# Altium project Test Carrier Bd.PrjPcb (part 1 of 2)
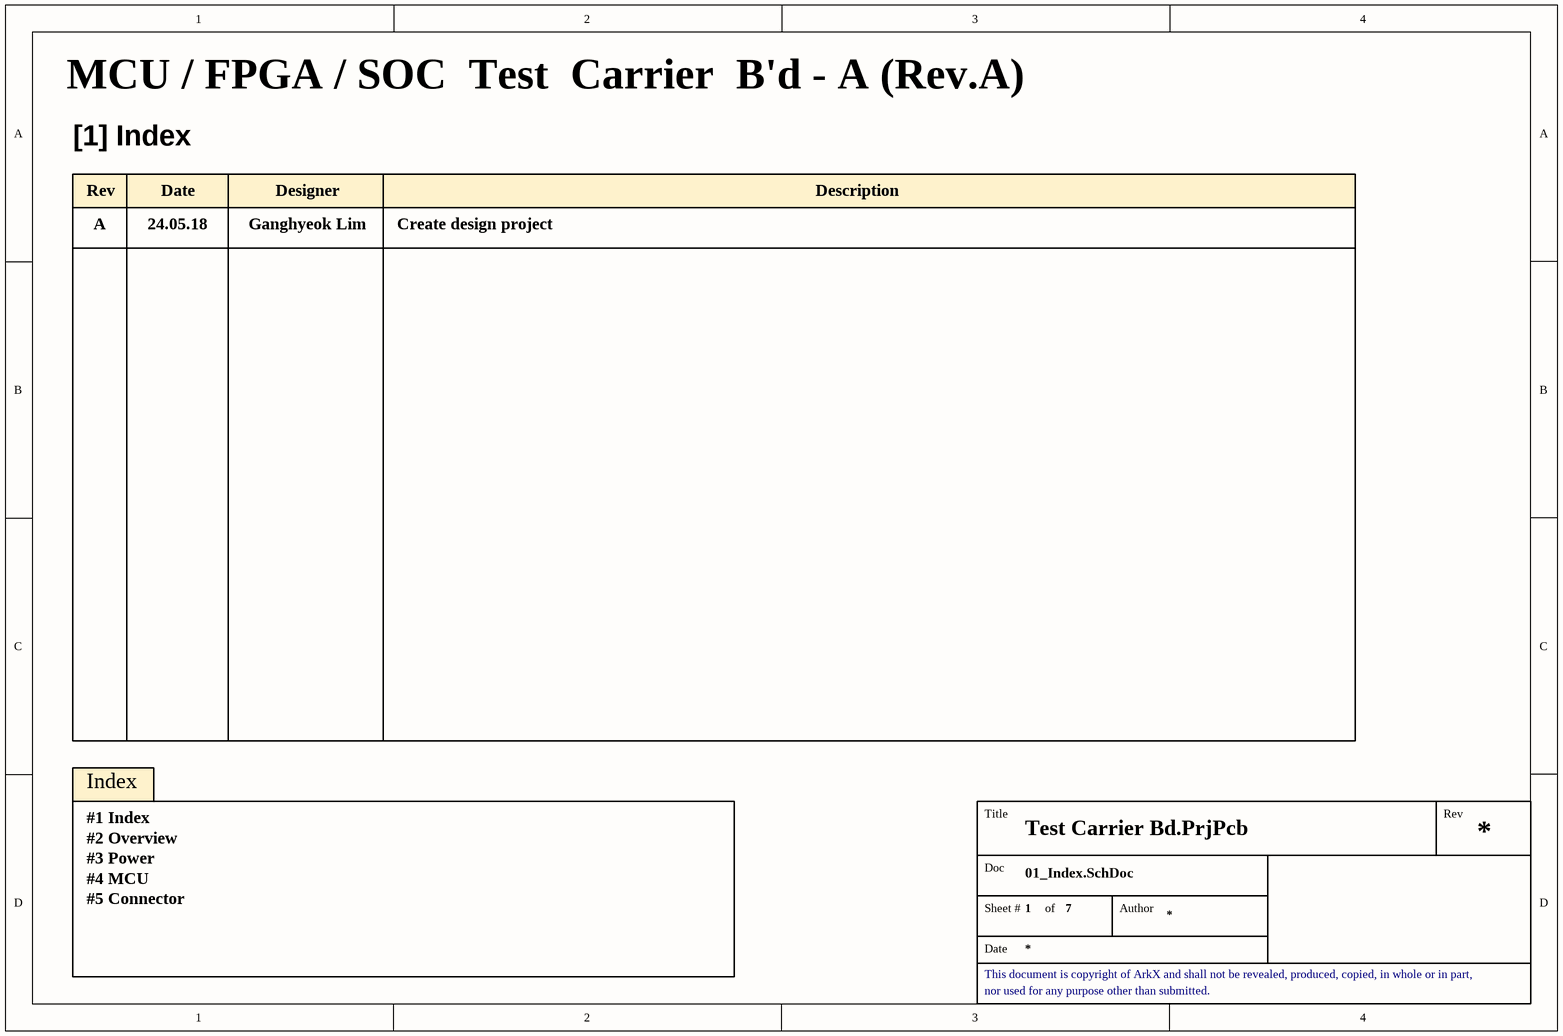
[diagram p0: 01_Index.SchDoc]
8 sheets, 219 parts. Net scope: global (net labels, ports and power ports of the same name join across sheets).
Board file: Test_Carrier_Bd.PcbDoc
Sheets:
  01_Index.SchDoc
  02_Overview.SchDoc
  03_Power.SchDoc
  04_MCU_Part.SchDoc
  05_FPGA_SOC_Part1.SchDoc
  06_FPGA_SOC_Part2.SchDoc
  07_Peripheral_Part.SchDoc
  08_Target_Bd_Connector.SchDoc

## Sheet 01_Index.SchDoc
size A4; SheetNumber: 1; SheetTotal: 7

### Notes on the sheet
- MCU / FPGA / SOC  Test  Carrier  B'd - A (Rev.A)
- [1] Index
- Rev
- A
- 24.05.18
- Date
- Ganghyeok Lim
- Designer
- Create design project
- Description
- Index
- #1 Index
- #2 Overview
- #3 Power
- #4 MCU
- #5 Connector
- Title
- Doc
- Sheet #
- of
- Author
- This document is copyright of ArkX and shall not be revealed, produced, copied, in whole or in part,
- nor used for any purpose other than submitted.

## Sheet 02_Overview.SchDoc
size A4; SheetNumber: 2; SheetTotal: 7
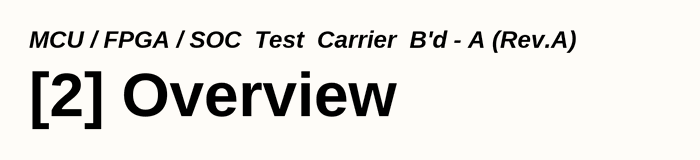
[diagram p1: 02_Overview.SchDoc]

### Notes on the sheet
- MCU / FPGA / SOC  Test  Carrier  B'd - A (Rev.A)
- [2] Overview
- Title
- Rev
- Doc
- Sheet #
- of
- Author
- This document is copyright of ArkX and shall not be revealed, produced, copied, in whole or in part,
- Date
- nor used for any purpose other than submitted.

## Sheet 03_Power.SchDoc
size A4; SheetNumber: 3; SheetTotal: 8
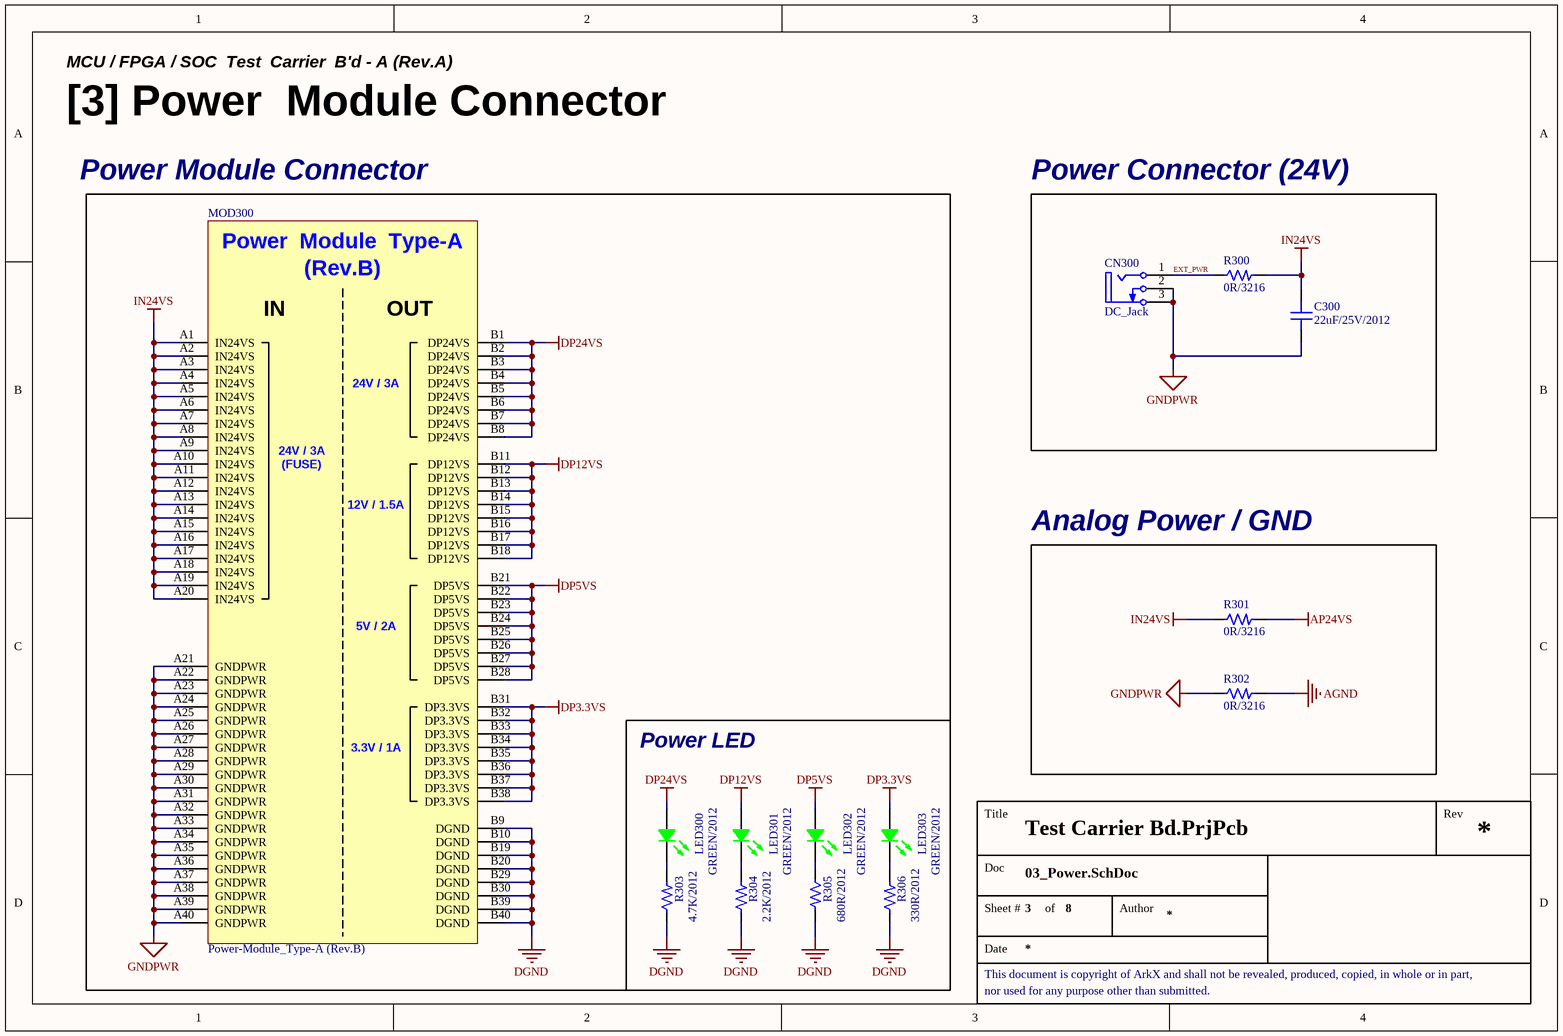
[diagram p2: 03_Power.SchDoc]

### Parts
C300  22uF/25V/2012  [CAP 2012 (0805_INCH)]
CN300  DC_Jack  [CON_DC-JACK]
LED300  GREEN/2012  [LED MHT170RGBCT (GREEN)]
LED301  GREEN/2012  [LED MHT170RGBCT (GREEN)]
LED302  GREEN/2012  [LED MHT170RGBCT (GREEN)]
LED303  GREEN/2012  [LED MHT170RGBCT (GREEN)]
MOD300  Power-Module_Type-A (Rev.B)  [MOD_Power-Module_Type-A (Rev.B)]
R300  0R/3216  [RES 3216 (1206_inch)]
R301  0R/3216  [RES 3216 (1206_inch)]
R302  0R/3216  [RES 3216 (1206_inch)]
R303  4.7K/2012  [RES 2012 (0805_inch)]
R304  2.2K/2012  [RES 2012 (0805_inch)]
R305  680R/2012  [RES 2012 (0805_inch)]
R306  330R/2012  [RES 2012 (0805_inch)]

### Blocks framed on the sheet
Power Connector (24V): C300 CN300 R300
Analog Power / GND: R301 R302
Power LED: LED300-LED303 R303-R306

### Nets
AGND: R302.2
AP24VS: R301.2
DGND: MOD300.B9(DGND) MOD300.B10(DGND) MOD300.B19(DGND) MOD300.B20(DGND) MOD300.B29(DGND) MOD300.B30(DGND) MOD300.B39(DGND) MOD300.B40(DGND) R303.1 R304.1 R305.2 R306.1
DP3.3VS: LED303.4(Common_Anode) MOD300.B31(DP3.3VS) MOD300.B32(DP3.3VS) MOD300.B33(DP3.3VS) MOD300.B34(DP3.3VS) MOD300.B35(DP3.3VS) MOD300.B36(DP3.3VS) MOD300.B37(DP3.3VS) MOD300.B38(DP3.3VS)
DP5VS: LED302.4(Common_Anode) MOD300.B21(DP5VS) MOD300.B22(DP5VS) MOD300.B23(DP5VS) MOD300.B24(DP5VS) MOD300.B25(DP5VS) MOD300.B26(DP5VS) MOD300.B27(DP5VS) MOD300.B28(DP5VS)
DP12VS: LED301.4(Common_Anode) MOD300.B11(DP12VS) MOD300.B12(DP12VS) MOD300.B13(DP12VS) MOD300.B14(DP12VS) MOD300.B15(DP12VS) MOD300.B16(DP12VS) MOD300.B17(DP12VS) MOD300.B18(DP12VS)
DP24VS: LED300.4(Common_Anode) MOD300.B1(DP24VS) MOD300.B2(DP24VS) MOD300.B3(DP24VS) MOD300.B4(DP24VS) MOD300.B5(DP24VS) MOD300.B6(DP24VS) MOD300.B7(DP24VS) MOD300.B8(DP24VS)
GNDPWR: C300.2 CN300.2(GND) CN300.3(GND) MOD300.A21(GNDPWR) MOD300.A22(GNDPWR) MOD300.A23(GNDPWR) MOD300.A24(GNDPWR) MOD300.A25(GNDPWR) MOD300.A26(GNDPWR) MOD300.A27(GNDPWR) MOD300.A28(GNDPWR) MOD300.A29(GNDPWR) MOD300.A30(GNDPWR) MOD300.A31(GNDPWR) MOD300.A32(GNDPWR) MOD300.A33(GNDPWR) MOD300.A34(GNDPWR) MOD300.A35(GNDPWR) MOD300.A36(GNDPWR) MOD300.A37(GNDPWR) MOD300.A38(GNDPWR) MOD300.A39(GNDPWR) MOD300.A40(GNDPWR) R302.1
IN24VS: C300.1 MOD300.A1(IN24VS) MOD300.A2(IN24VS) MOD300.A3(IN24VS) MOD300.A4(IN24VS) MOD300.A5(IN24VS) MOD300.A6(IN24VS) MOD300.A7(IN24VS) MOD300.A8(IN24VS) MOD300.A9(IN24VS) MOD300.A10(IN24VS) MOD300.A11(IN24VS) MOD300.A12(IN24VS) MOD300.A13(IN24VS) MOD300.A14(IN24VS) MOD300.A15(IN24VS) MOD300.A16(IN24VS) MOD300.A17(IN24VS) MOD300.A18(IN24VS) MOD300.A19(IN24VS) MOD300.A20(IN24VS) R300.2 R301.1
EXT_PWR: CN300.1(VCC) R300.1
NetLED300_2: LED300.2(GREEN) R303.2
NetLED301_2: LED301.2(GREEN) R304.2
NetLED302_2: LED302.2(GREEN) R305.1
NetLED303_2: LED303.2(GREEN) R306.2

### Notes on the sheet
- MCU / FPGA / SOC  Test  Carrier  B'd - A (Rev.A)
- [3] Power  Module Connector
- Power Module Connector
- Title
- Rev
- Doc
- Sheet #
- of
- Author
- This document is copyright of ArkX and shall not be revealed, produced, copied, in whole or in part,
- Date
- nor used for any purpose other than submitted.
- (in symbol MOD_Power-Module_Type-A (Rev.B)) Power  Module  Type-A; (Rev.B); IN; OUT; 24V / 3A; (FUSE); 12V / 1.5A; 5V / 2A; 3.3V / 1A

### Library data of the parts
C300 = CAP_22uF/25V/2012: Ceramic CAP_22uF/25V/2012; LCSC Part #: C45783; JLCPCB Part Type: Basic Part
CN300 = CON_DC-Jack: ComponentLink1Description: Manufacturer Link; ComponentLink1URL: http://www.cliffuk.co.uk/
LED300-LED303 = LED_MHT170RGBCT(GREEN): Colorless transparence -30℃~+85℃ Positive post Common anode RGB 120° 0805  Light Emitting Diodes (LED) ROHS; LCSC Part #: C2962094; JLCPCB Part Type: Extended Part
MOD300 = MOD_Power-Module_Type-A (Rev.B): Power-Module_(Type-A / Rev.B)
R300-R302 = RES_0R/3216/0.25W: Power Rating: 0.1W; Precision: 1%; Size: 1608; LCSC Part #: C17888; JLCPCB Part Type: Basic Part
R303 = RES_4.7K/2012/0.125W: Value: 4.7K; Power Rating: 0.125W; Precision: 1%; Size: 2012; LCSC Part #: C17673; JLCPCB Part Type: Basic Part
R304 = RES_2.2K/2012/0.125W: Value: 2.2K; Power Rating: 0.125W; Precision: 1%; Size: 2012; LCSC Part #: C17520; JLCPCB Part Type: Basic Part
R305 = RES_680R/2012/0.125W: Value: 680R; Power Rating: 0.125W; Precision: 1%; Size: 2012; LCSC Part #: C17798; JLCPCB Part Type: Basic Part
R306 = RES_330R/2012/0.125W: Value: 330R; Power Rating: 0.125W; Precision: 1%; Size: 2012; LCSC Part #: C17630; JLCPCB Part Type: Basic Part

## Sheet 04_MCU_Part.SchDoc
size A3; SheetNumber: 4; SheetTotal: 8
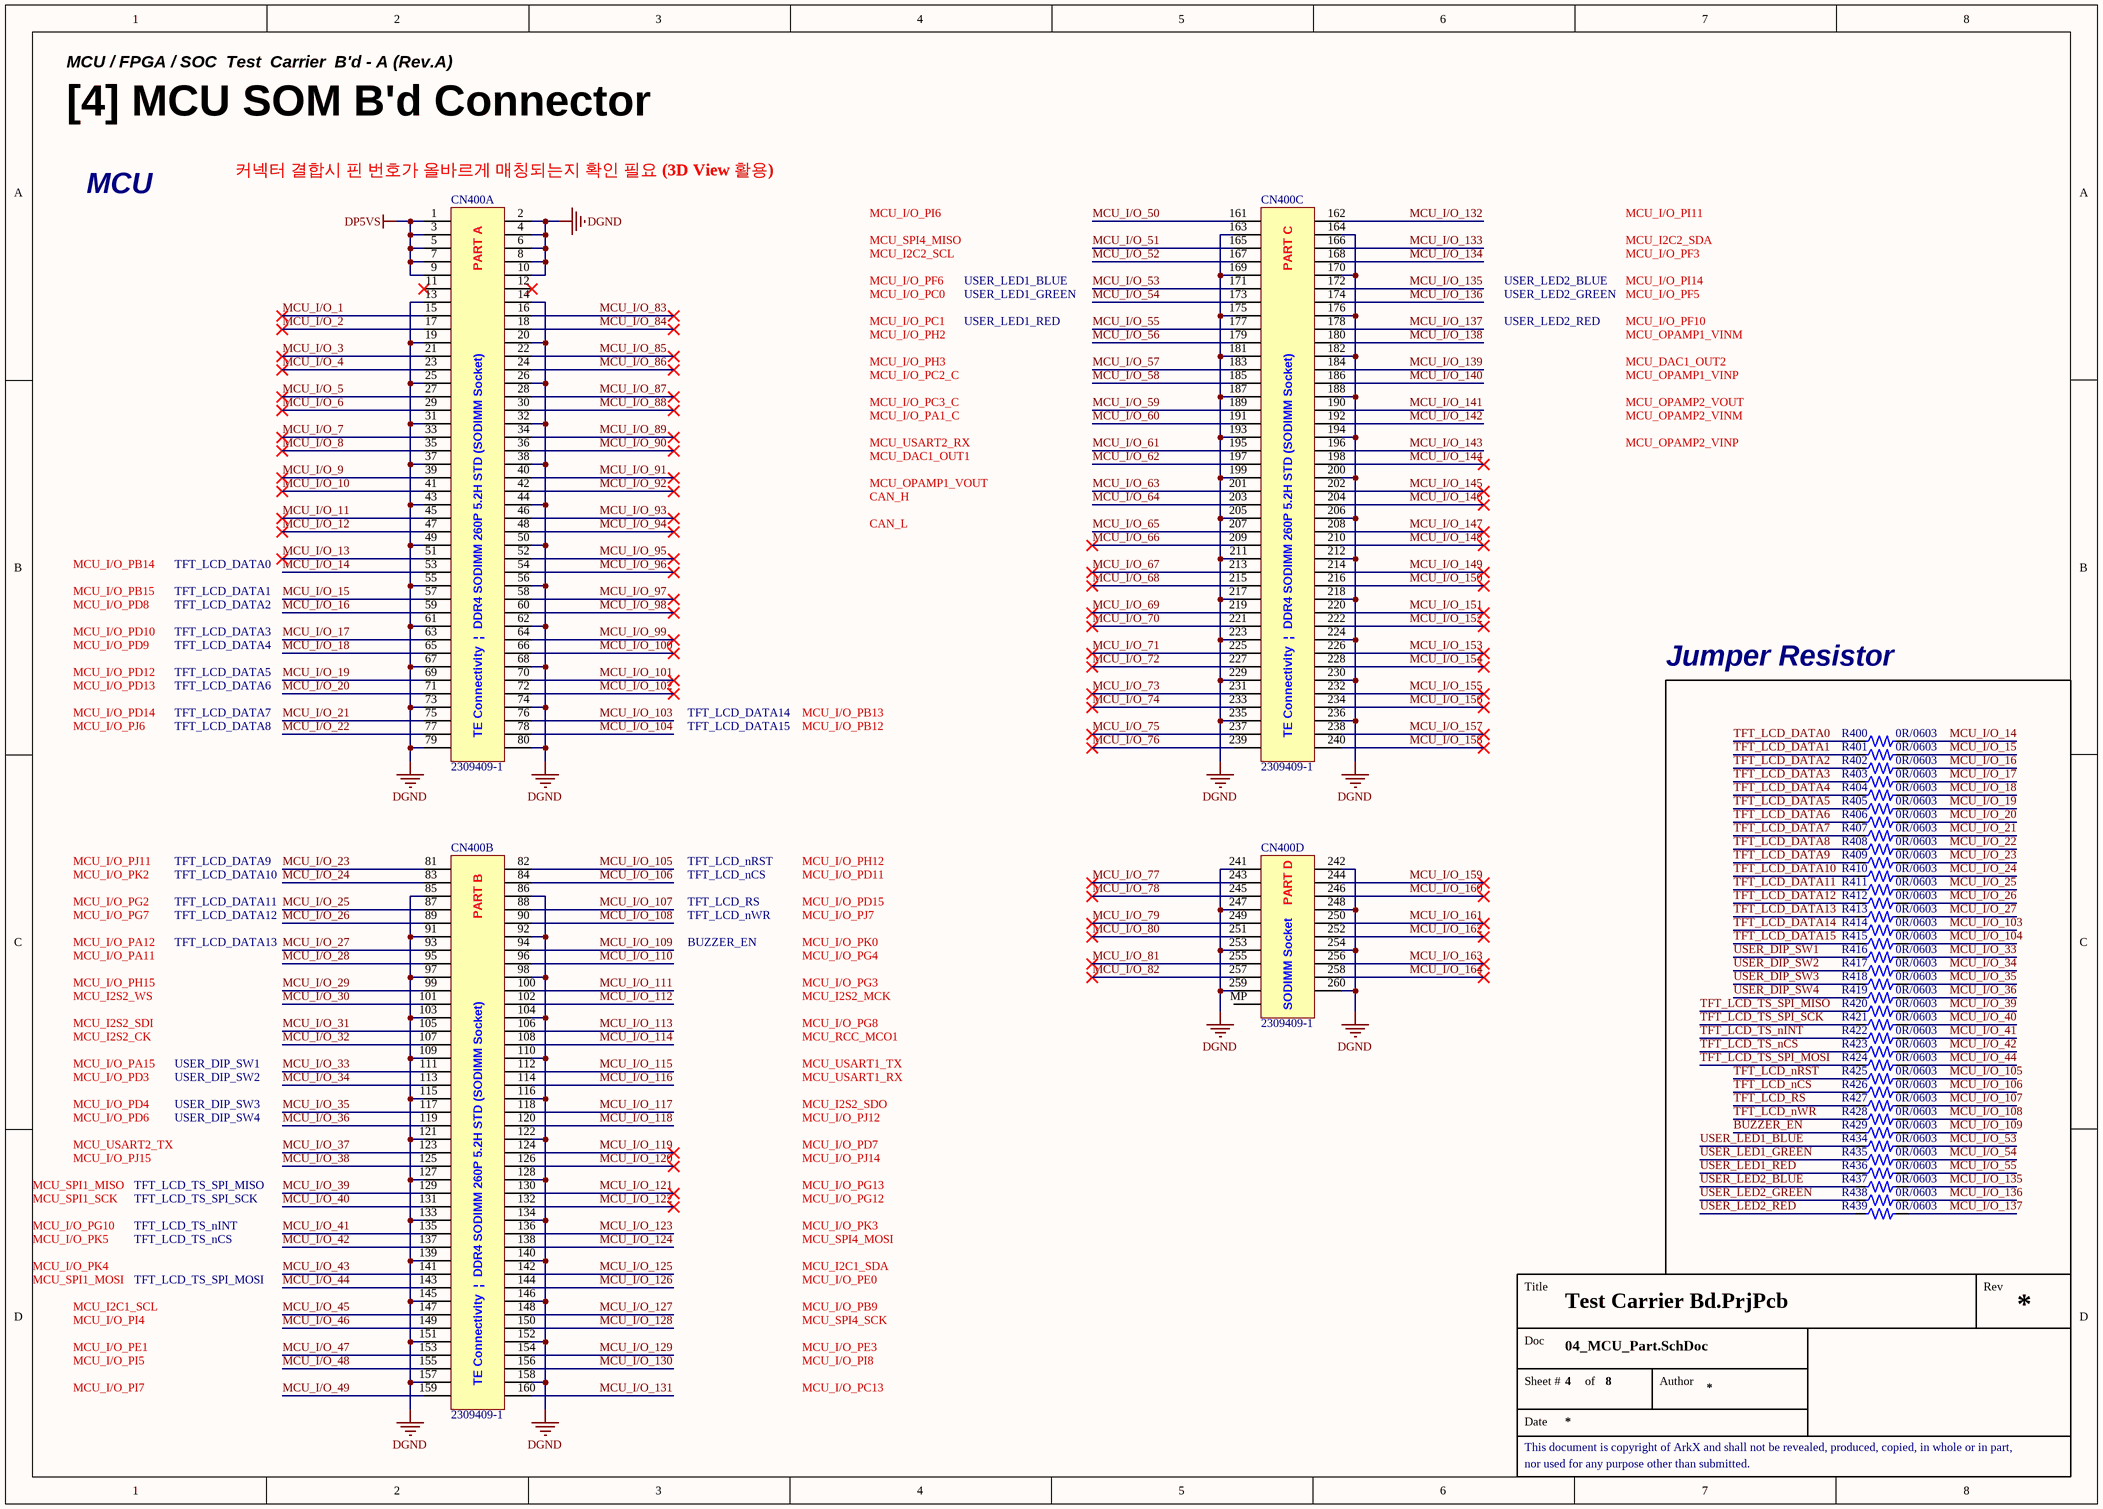
[diagram p3: 04_MCU_Part.SchDoc]

### Parts
CN400  2309409-1  [CON_SODIMM_2309409-1]  (parts A,B,C,D of 4)
R400  0R/0603  [RES 0603 (0201_inch)]
R401  0R/0603  [RES 0603 (0201_inch)]
R402  0R/0603  [RES 0603 (0201_inch)]
R403  0R/0603  [RES 0603 (0201_inch)]
R404  0R/0603  [RES 0603 (0201_inch)]
R405  0R/0603  [RES 0603 (0201_inch)]
R406  0R/0603  [RES 0603 (0201_inch)]
R407  0R/0603  [RES 0603 (0201_inch)]
R408  0R/0603  [RES 0603 (0201_inch)]
R409  0R/0603  [RES 0603 (0201_inch)]
R410  0R/0603  [RES 0603 (0201_inch)]
R411  0R/0603  [RES 0603 (0201_inch)]
R412  0R/0603  [RES 0603 (0201_inch)]
R413  0R/0603  [RES 0603 (0201_inch)]
R414  0R/0603  [RES 0603 (0201_inch)]
R415  0R/0603  [RES 0603 (0201_inch)]
R416  0R/0603  [RES 0603 (0201_inch)]
R417  0R/0603  [RES 0603 (0201_inch)]
R418  0R/0603  [RES 0603 (0201_inch)]
R419  0R/0603  [RES 0603 (0201_inch)]
R420  0R/0603  [RES 0603 (0201_inch)]
R421  0R/0603  [RES 0603 (0201_inch)]
R422  0R/0603  [RES 0603 (0201_inch)]
R423  0R/0603  [RES 0603 (0201_inch)]
R424  0R/0603  [RES 0603 (0201_inch)]
R425  0R/0603  [RES 0603 (0201_inch)]
R426  0R/0603  [RES 0603 (0201_inch)]
R427  0R/0603  [RES 0603 (0201_inch)]
R428  0R/0603  [RES 0603 (0201_inch)]
R429  0R/0603  [RES 0603 (0201_inch)]
R434  0R/0603  [RES 0603 (0201_inch)]
R435  0R/0603  [RES 0603 (0201_inch)]
R436  0R/0603  [RES 0603 (0201_inch)]
R437  0R/0603  [RES 0603 (0201_inch)]
R438  0R/0603  [RES 0603 (0201_inch)]
R439  0R/0603  [RES 0603 (0201_inch)]

### Blocks framed on the sheet
Jumper Resistor: R400-R429 R434-R439

### Nets
DGND: CN400.2 CN400.4 CN400.6 CN400.8 CN400.10 CN400.13 CN400.14 CN400.19 CN400.20 CN400.25 CN400.26 CN400.31 CN400.32 CN400.37 CN400.38 CN400.43 CN400.44 CN400.49 CN400.50 CN400.55 CN400.56 CN400.61 CN400.62 CN400.67 CN400.68 CN400.73 CN400.74 CN400.79 CN400.80 CN400.85 CN400.86 CN400.91 CN400.92 CN400.97 CN400.98 CN400.103 CN400.104 CN400.109 CN400.110 CN400.115 CN400.116 CN400.121 CN400.122 CN400.127 CN400.128 CN400.133 CN400.134 CN400.139 CN400.140 CN400.145 CN400.146 CN400.151 CN400.152 CN400.157 CN400.158 CN400.163 CN400.164 CN400.169 CN400.170 CN400.175 CN400.176 CN400.181 CN400.182 CN400.187 CN400.188 CN400.193 CN400.194 CN400.199 CN400.200 CN400.205 CN400.206 CN400.211 CN400.212 CN400.217 CN400.218 CN400.223 CN400.224 CN400.229 CN400.230 CN400.235 CN400.236 CN400.241 CN400.242 CN400.247 CN400.248 CN400.253 CN400.254 CN400.259 CN400.260
DP5VS: CN400.1 CN400.3 CN400.5 CN400.7 CN400.9
BUZZER_EN: R429.1
MCU_I/O_1: CN400.15
MCU_I/O_2: CN400.17
MCU_I/O_3: CN400.21
MCU_I/O_4: CN400.23
MCU_I/O_5: CN400.27
MCU_I/O_6: CN400.29
MCU_I/O_7: CN400.33
MCU_I/O_8: CN400.35
MCU_I/O_9: CN400.39
MCU_I/O_10: CN400.41
MCU_I/O_11: CN400.45
MCU_I/O_12: CN400.47
MCU_I/O_13: CN400.51
MCU_I/O_14: CN400.53 R400.2
MCU_I/O_15: CN400.57 R401.2
MCU_I/O_16: CN400.59 R402.2
MCU_I/O_17: CN400.63 R403.2
MCU_I/O_18: CN400.65 R404.2
MCU_I/O_19: CN400.69 R405.2
MCU_I/O_20: CN400.71 R406.2
MCU_I/O_21: CN400.75 R407.2
MCU_I/O_22: CN400.77 R408.2
MCU_I/O_23: CN400.81 R409.2
MCU_I/O_24: CN400.83 R410.2
MCU_I/O_25: CN400.87 R411.2
MCU_I/O_26: CN400.89 R412.2
MCU_I/O_27: CN400.93 R413.2
MCU_I/O_28: CN400.95
MCU_I/O_29: CN400.99
MCU_I/O_30: CN400.101
MCU_I/O_31: CN400.105
MCU_I/O_32: CN400.107
MCU_I/O_33: CN400.111 R416.2
MCU_I/O_34: CN400.113 R417.2
MCU_I/O_35: CN400.117 R418.2
MCU_I/O_36: CN400.119 R419.2
MCU_I/O_37: CN400.123
MCU_I/O_38: CN400.125
MCU_I/O_39: CN400.129 R420.2
MCU_I/O_40: CN400.131 R421.2
MCU_I/O_41: CN400.135 R422.2
MCU_I/O_42: CN400.137 R423.2
MCU_I/O_43: CN400.141
MCU_I/O_44: CN400.143 R424.2
MCU_I/O_45: CN400.147
MCU_I/O_46: CN400.149
MCU_I/O_47: CN400.153
MCU_I/O_48: CN400.155
MCU_I/O_49: CN400.159
MCU_I/O_50: CN400.161
MCU_I/O_51: CN400.165
MCU_I/O_52: CN400.167
MCU_I/O_53: CN400.171 R434.2
MCU_I/O_54: CN400.173 R435.2
MCU_I/O_55: CN400.177 R436.2
MCU_I/O_56: CN400.179
MCU_I/O_57: CN400.183
MCU_I/O_58: CN400.185
MCU_I/O_59: CN400.189
MCU_I/O_60: CN400.191
MCU_I/O_61: CN400.195
MCU_I/O_62: CN400.197
MCU_I/O_63: CN400.201
MCU_I/O_64: CN400.203
MCU_I/O_65: CN400.207
MCU_I/O_66: CN400.209
MCU_I/O_67: CN400.213
MCU_I/O_68: CN400.215
MCU_I/O_69: CN400.219
MCU_I/O_70: CN400.221
MCU_I/O_71: CN400.225
MCU_I/O_72: CN400.227
MCU_I/O_73: CN400.231
MCU_I/O_74: CN400.233
MCU_I/O_75: CN400.237
MCU_I/O_76: CN400.239
MCU_I/O_77: CN400.243
MCU_I/O_78: CN400.245
MCU_I/O_79: CN400.249
MCU_I/O_80: CN400.251
MCU_I/O_81: CN400.255
MCU_I/O_82: CN400.257
MCU_I/O_83: CN400.16
MCU_I/O_84: CN400.18
MCU_I/O_85: CN400.22
MCU_I/O_86: CN400.24
MCU_I/O_87: CN400.28
MCU_I/O_88: CN400.30
MCU_I/O_89: CN400.34
MCU_I/O_90: CN400.36
MCU_I/O_91: CN400.40
MCU_I/O_92: CN400.42
MCU_I/O_93: CN400.46
MCU_I/O_94: CN400.48
MCU_I/O_95: CN400.52
MCU_I/O_96: CN400.54
MCU_I/O_97: CN400.58
MCU_I/O_98: CN400.60
MCU_I/O_99: CN400.64
MCU_I/O_100: CN400.66
MCU_I/O_101: CN400.70
MCU_I/O_102: CN400.72
MCU_I/O_103: CN400.76 R414.2
MCU_I/O_104: CN400.78 R415.2
MCU_I/O_105: CN400.82 R425.2
MCU_I/O_106: CN400.84 R426.2
MCU_I/O_107: CN400.88 R427.2
MCU_I/O_108: CN400.90 R428.2
MCU_I/O_109: CN400.94 R429.2
MCU_I/O_110: CN400.96
MCU_I/O_111: CN400.100
MCU_I/O_112: CN400.102
MCU_I/O_113: CN400.106
MCU_I/O_114: CN400.108
MCU_I/O_115: CN400.112
MCU_I/O_116: CN400.114
MCU_I/O_117: CN400.118
MCU_I/O_118: CN400.120
MCU_I/O_119: CN400.124
MCU_I/O_120: CN400.126
MCU_I/O_121: CN400.130
MCU_I/O_122: CN400.132
MCU_I/O_123: CN400.136
MCU_I/O_124: CN400.138
MCU_I/O_125: CN400.142
MCU_I/O_126: CN400.144
MCU_I/O_127: CN400.148
MCU_I/O_128: CN400.150
MCU_I/O_129: CN400.154
MCU_I/O_130: CN400.156
MCU_I/O_131: CN400.160
MCU_I/O_132: CN400.162
MCU_I/O_133: CN400.166
MCU_I/O_134: CN400.168
MCU_I/O_135: CN400.172 R437.2
MCU_I/O_136: CN400.174 R438.2
MCU_I/O_137: CN400.178 R439.2
MCU_I/O_138: CN400.180
MCU_I/O_139: CN400.184
MCU_I/O_140: CN400.186
MCU_I/O_141: CN400.190
MCU_I/O_142: CN400.192
MCU_I/O_143: CN400.196
MCU_I/O_144: CN400.198
MCU_I/O_145: CN400.202
MCU_I/O_146: CN400.204
MCU_I/O_147: CN400.208
MCU_I/O_148: CN400.210
MCU_I/O_149: CN400.214
MCU_I/O_150: CN400.216
MCU_I/O_151: CN400.220
MCU_I/O_152: CN400.222
MCU_I/O_153: CN400.226
MCU_I/O_154: CN400.228
MCU_I/O_155: CN400.232
MCU_I/O_156: CN400.234
MCU_I/O_157: CN400.238
MCU_I/O_158: CN400.240
MCU_I/O_159: CN400.244
MCU_I/O_160: CN400.246
MCU_I/O_161: CN400.250
MCU_I/O_162: CN400.252
MCU_I/O_163: CN400.256
MCU_I/O_164: CN400.258
TFT_LCD_DATA0: R400.1
TFT_LCD_DATA1: R401.1
TFT_LCD_DATA2: R402.1
TFT_LCD_DATA3: R403.1
TFT_LCD_DATA4: R404.1
TFT_LCD_DATA5: R405.1
TFT_LCD_DATA6: R406.1
TFT_LCD_DATA7: R407.1
TFT_LCD_DATA8: R408.1
TFT_LCD_DATA9: R409.1
TFT_LCD_DATA10: R410.1
TFT_LCD_DATA11: R411.1
TFT_LCD_DATA12: R412.1
TFT_LCD_DATA13: R413.1
TFT_LCD_DATA14: R414.1
TFT_LCD_DATA15: R415.1
TFT_LCD_nCS: R426.1
TFT_LCD_nRST: R425.1
TFT_LCD_nWR: R428.1
TFT_LCD_RS: R427.1
TFT_LCD_TS_nCS: R423.1
TFT_LCD_TS_nINT: R422.1
TFT_LCD_TS_SPI_MISO: R420.1
TFT_LCD_TS_SPI_MOSI: R424.1
TFT_LCD_TS_SPI_SCK: R421.1
USER_DIP_SW1: R416.1
USER_DIP_SW2: R417.1
USER_DIP_SW3: R418.1
USER_DIP_SW4: R419.1
USER_LED1_BLUE: R434.1
USER_LED1_GREEN: R435.1
USER_LED1_RED: R436.1
USER_LED2_BLUE: R437.1
USER_LED2_GREEN: R438.1
USER_LED2_RED: R439.1

Not connected (* = marked no-connect by the designer): CN400 11* 12* MP

### Notes on the sheet
- MCU / FPGA / SOC  Test  Carrier  B'd - A (Rev.A)
- [4] MCU SOM B'd Connector
- (near CN400) 커넥터 결합시 핀 번호가 올바르게 매칭되는지 확인 필요 (3D View 활용)
- MCU
- MCU_I/O_PI6
- MCU_SPI4_MISO
- MCU_I/O_PI11
- MCU_I2C2_SDA
- MCU_I2C2_SCL
- MCU_I/O_PF6
- MCU_I/O_PC0
- USER_LED1_BLUE
- USER_LED1_GREEN
- USER_LED2_BLUE
- USER_LED2_GREEN
- MCU_I/O_PF3
- MCU_I/O_PI14
- MCU_I/O_PF5
- MCU_I/O_PC1
- MCU_I/O_PH2
- MCU_I/O_PH3
- MCU_I/O_PC2_C
- USER_LED1_RED
- USER_LED2_RED
- MCU_I/O_PF10
- MCU_OPAMP1_VINM
- MCU_DAC1_OUT2
- MCU_OPAMP1_VINP
- MCU_I/O_PC3_C
- MCU_I/O_PA1_C
- MCU_USART2_RX
- MCU_OPAMP2_VOUT
- MCU_OPAMP2_VINM
- MCU_OPAMP2_VINP
- MCU_DAC1_OUT1
- MCU_OPAMP1_VOUT
- CAN_H
- MCU_I/O_PB14
- TFT_LCD_DATA0
- CAN_L
- MCU_I/O_PB15
- MCU_I/O_PD8
- MCU_I/O_PD10
- MCU_I/O_PD9
- TFT_LCD_DATA1
- TFT_LCD_DATA2
- TFT_LCD_DATA3
- TFT_LCD_DATA4
- MCU_I/O_PD12
- MCU_I/O_PD13
- MCU_I/O_PD14
- TFT_LCD_DATA5
- TFT_LCD_DATA6
- TFT_LCD_DATA7
- TFT_LCD_DATA14
- MCU_I/O_PB13
- MCU_I/O_PJ6
- TFT_LCD_DATA8
- TFT_LCD_DATA15
- MCU_I/O_PB12
- MCU_I/O_PJ11
- MCU_I/O_PK2
- MCU_I/O_PG2
- MCU_I/O_PG7
- TFT_LCD_DATA9
- TFT_LCD_DATA10
- TFT_LCD_DATA11
- TFT_LCD_DATA12
- TFT_LCD_nRST
- TFT_LCD_nCS
- TFT_LCD_RS
- TFT_LCD_nWR
- MCU_I/O_PH12
- MCU_I/O_PD11
- MCU_I/O_PD15
- MCU_I/O_PJ7
- MCU_I/O_PA12
- MCU_I/O_PA11
- MCU_I/O_PH15
- TFT_LCD_DATA13
- BUZZER_EN
- MCU_I/O_PK0
- MCU_I/O_PG4
- MCU_I/O_PG3
- MCU_I2S2_WS
- MCU_I2S2_SDI
- MCU_I2S2_CK
- MCU_I2S2_MCK
- MCU_I/O_PG8
- MCU_RCC_MCO1
- MCU_I/O_PA15
- MCU_I/O_PD3
- MCU_I/O_PD4
- MCU_I/O_PD6
- USER_DIP_SW1
- USER_DIP_SW2
- USER_DIP_SW3
- USER_DIP_SW4
- MCU_USART1_TX
- MCU_USART1_RX
- MCU_I2S2_SDO
- MCU_I/O_PJ12
- MCU_SPI1_MISO
- MCU_USART2_TX
- MCU_I/O_PJ15
- TFT_LCD_TS_SPI_MISO
- MCU_I/O_PD7
- MCU_I/O_PJ14
- MCU_I/O_PG13
- MCU_SPI1_SCK
- MCU_I/O_PG10
- MCU_I/O_PK5
- TFT_LCD_TS_SPI_SCK
- TFT_LCD_TS_nINT
- TFT_LCD_TS_nCS
- MCU_I/O_PG12
- MCU_I/O_PK3
- MCU_SPI4_MOSI
- MCU_I/O_PK4
- MCU_SPI1_MOSI
- MCU_I2C1_SCL
- MCU_I/O_PI4
- TFT_LCD_TS_SPI_MOSI
- MCU_I2C1_SDA
- MCU_I/O_PE0
- MCU_I/O_PB9
- MCU_SPI4_SCK
- MCU_I/O_PE1
- MCU_I/O_PI5
- MCU_I/O_PI7
- MCU_I/O_PE3
- MCU_I/O_PI8
- MCU_I/O_PC13
- Title
- Rev
- Doc
- Sheet #
- of
- Author
- This document is copyright of ArkX and shall not be revealed, produced, copied, in whole or in part,
- Date
- nor used for any purpose other than submitted.
- (in symbol CON_SODIMM_2309409-1, part A) PART A; TE Connectivity  |  DDR4 SODIMM 260P 5.2H STD (SODIMM Socket)
- (in symbol CON_SODIMM_2309409-1, part B) PART B; TE Connectivity  |  DDR4 SODIMM 260P 5.2H STD (SODIMM Socket)
- (in symbol CON_SODIMM_2309409-1, part C) PART C; TE Connectivity  |  DDR4 SODIMM 260P 5.2H STD (SODIMM Socket)
- (in symbol CON_SODIMM_2309409-1, part D) PART D; SODIMM Socket

### Library data of the parts
CN400 = CON_SODIMM_2309409-1: SO DIMM Socket, Small Outline (SO), Stack Height .205 in [5.2 mm], Right Angle Module Orientation, 260 Position, DDR4 DIMM; Manufacturer: TE Connectivity; Manufacturer Part Number: 2309409-1; JLCPCB Part Type: Extended Part; LCSC Part #: C5164025
R400-R429 R434-R439 = RES_0R/0603/50mW: 50mW Thick Film Resistors 25V ±1% 0Ω 0201  Chip Resistor - Surface Mount ROHS; Value: 0R; Size: 0603; Power Rating: 50mW; Precision: 1%; LCSC Part #: C106227; JLCPCB Part Type: Extended Part

## Sheet 05_FPGA_SOC_Part1.SchDoc
size A3; SheetNumber: 5; SheetTotal: 8
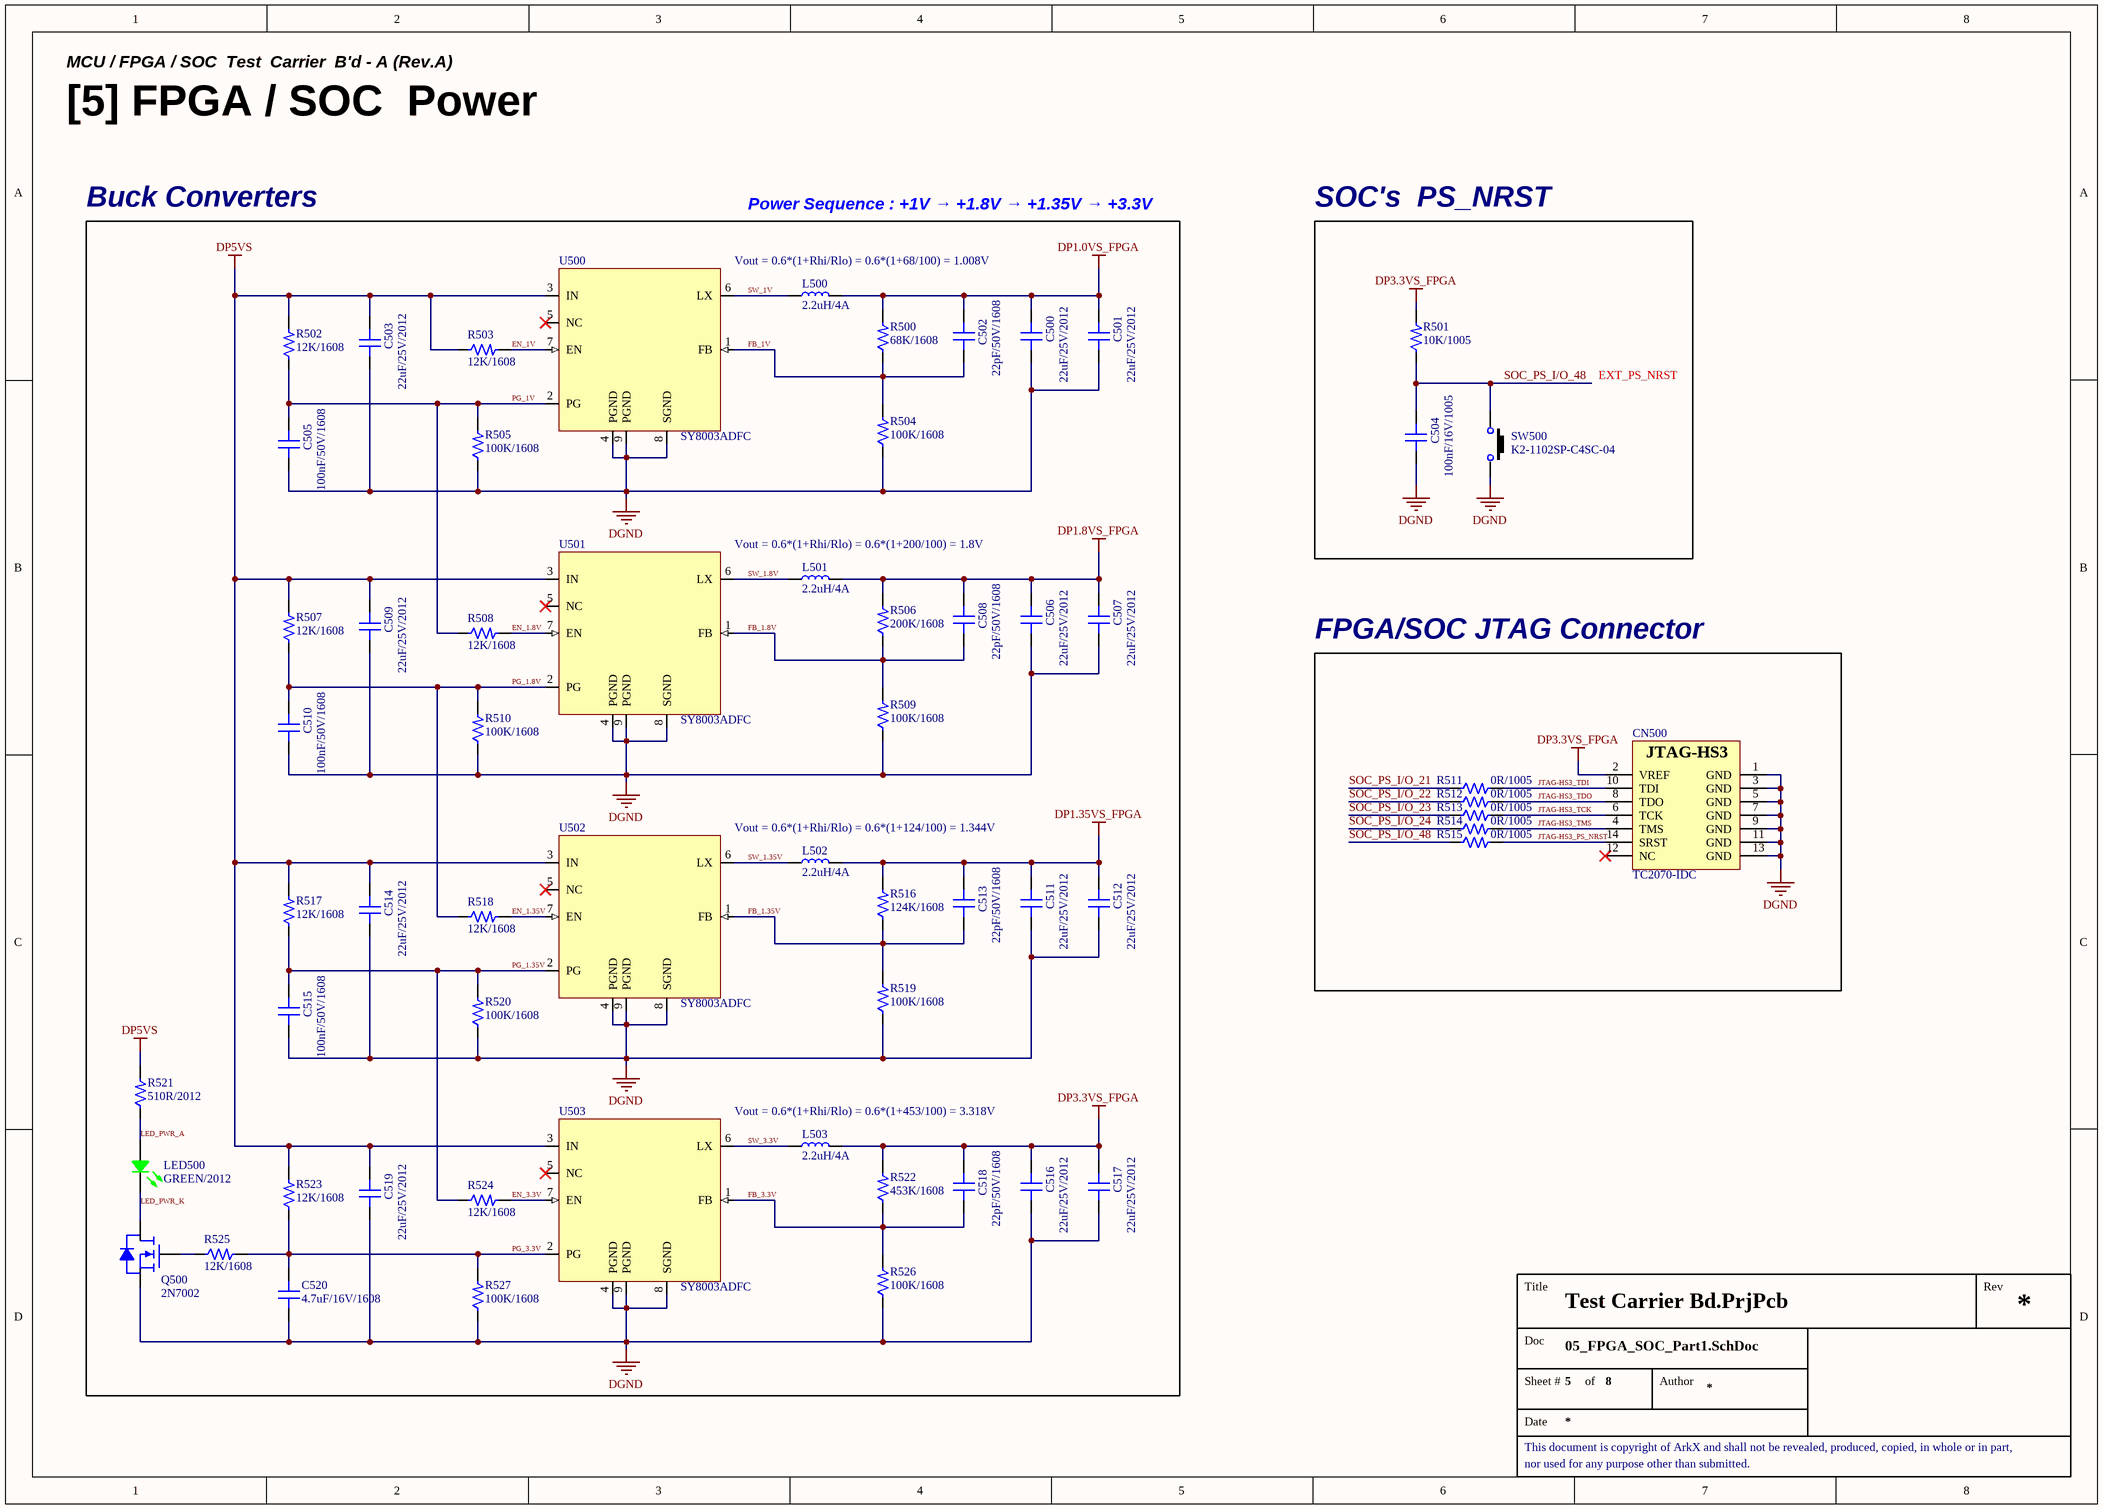
[diagram p4: 05_FPGA_SOC_Part1.SchDoc]

### Parts
C500  22uF/25V/2012  [CAP 2012 (0805_INCH)]
C501  22uF/25V/2012  [CAP 2012 (0805_INCH)]
C502  22pF/50V/1608  [CAP 1608 (0603_INCH)]
C503  22uF/25V/2012  [CAP 2012 (0805_INCH)]
C504  100nF/16V/1005  [CAP 1005 (0402_INCH)]
C505  100nF/50V/1608  [CAP 1608 (0603_INCH)]
C506  22uF/25V/2012  [CAP 2012 (0805_INCH)]
C507  22uF/25V/2012  [CAP 2012 (0805_INCH)]
C508  22pF/50V/1608  [CAP 1608 (0603_INCH)]
C509  22uF/25V/2012  [CAP 2012 (0805_INCH)]
C510  100nF/50V/1608  [CAP 1608 (0603_INCH)]
C511  22uF/25V/2012  [CAP 2012 (0805_INCH)]
C512  22uF/25V/2012  [CAP 2012 (0805_INCH)]
C513  22pF/50V/1608  [CAP 1608 (0603_INCH)]
C514  22uF/25V/2012  [CAP 2012 (0805_INCH)]
C515  100nF/50V/1608  [CAP 1608 (0603_INCH)]
C516  22uF/25V/2012  [CAP 2012 (0805_INCH)]
C517  22uF/25V/2012  [CAP 2012 (0805_INCH)]
C518  22pF/50V/1608  [CAP 1608 (0603_INCH)]
C519  22uF/25V/2012  [CAP 2012 (0805_INCH)]
C520  4.7uF/16V/1608  [CAP 1608 (0603_INCH)]
CN500  TC2070-IDC  [CON_TC2070-IDC]
L500  2.2uH/4A  [IND_2.2uH/4A/6x6_(BWVS006060282R2M00)]
L501  2.2uH/4A  [IND_2.2uH/4A/6x6_(BWVS006060282R2M00)]
L502  2.2uH/4A  [IND_2.2uH/4A/6x6_(BWVS006060282R2M00)]
L503  2.2uH/4A  [IND_2.2uH/4A/6x6_(BWVS006060282R2M00)]
LED500  GREEN/2012  [LED MHT170RGBCT (GREEN)]
Q500  2N7002  [SOT 23-3 (DIODES INCORPORATED)]
R500  68K/1608  [RES 1608 (0603_inch)]
R501  10K/1005  [RES 1005 (0402_inch)]
R502  12K/1608  [RES 1608 (0603_inch)]
R503  12K/1608  [RES 1608 (0603_inch)]
R504  100K/1608  [RES 1608 (0603_inch)]
R505  100K/1608  [RES 1608 (0603_inch)]
R506  200K/1608  [RES 1608 (0603_inch)]
R507  12K/1608  [RES 1608 (0603_inch)]
R508  12K/1608  [RES 1608 (0603_inch)]
R509  100K/1608  [RES 1608 (0603_inch)]
R510  100K/1608  [RES 1608 (0603_inch)]
R511  0R/1005  [RES 1005 (0402_inch)]
R512  0R/1005  [RES 1005 (0402_inch)]
R513  0R/1005  [RES 1005 (0402_inch)]
R514  0R/1005  [RES 1005 (0402_inch)]
R515  0R/1005  [RES 1005 (0402_inch)]
R516  124K/1608  [RES 1608 (0603_inch)]
R517  12K/1608  [RES 1608 (0603_inch)]
R518  12K/1608  [RES 1608 (0603_inch)]
R519  100K/1608  [RES 1608 (0603_inch)]
R520  100K/1608  [RES 1608 (0603_inch)]
R521  510R/2012  [RES 2012 (0805_inch)]
R522  453K/1608  [RES 1608 (0603_inch)]
R523  12K/1608  [RES 1608 (0603_inch)]
R524  12K/1608  [RES 1608 (0603_inch)]
R525  12K/1608  [RES 1608 (0603_inch)]
R526  100K/1608  [RES 1608 (0603_inch)]
R527  100K/1608  [RES 1608 (0603_inch)]
SW500  K2-1102SP-C4SC-04  [SW K2-1102SP-C4SC-04]
U500  SY8003ADFC  [IC_DFN_2X2_8L]
U501  SY8003ADFC  [IC_DFN_2X2_8L]
U502  SY8003ADFC  [IC_DFN_2X2_8L]
U503  SY8003ADFC  [IC_DFN_2X2_8L]

### Blocks framed on the sheet
Buck Converters: C500-C503 C505-C520 L500-L503 LED500 Q500 R500 R502-R510 R516-R527 U500-U503
SOC's  PS_NRST: C504 R501 SW500
FPGA/SOC JTAG Connector: CN500 R511-R515

### Nets
DGND: C500.1 C501.1 C503.1 C504.1 C505.1 C506.1 C507.1 C509.1 C510.1 C511.1 C512.1 C514.1 C515.1 C516.1 C517.1 C519.1 C520.1 CN500.1(GND) CN500.3(GND) CN500.5(GND) CN500.7(GND) CN500.9(GND) CN500.11(GND) CN500.13(GND) Q500.2(S) R504.1 R505.1 R509.1 R510.1 R519.1 R520.1 R526.1 R527.1 SW500.3 U500.4(PGND) U500.8(SGND) U500.9(PGND) U501.4(PGND) U501.8(SGND) U501.9(PGND) U502.4(PGND) U502.8(SGND) U502.9(PGND) U503.4(PGND) U503.8(SGND) U503.9(PGND)
DP1.0VS_FPGA: C500.2 C501.2 C502.2 L500.2 R500.2
DP1.8VS_FPGA: C506.2 C507.2 C508.2 L501.2 R506.2
DP1.35VS_FPGA: C511.2 C512.2 C513.2 L502.2 R516.2
DP3.3VS_FPGA: C516.2 C517.2 C518.2 CN500.2(VREF) L503.2 R501.2 R522.2
DP5VS: C503.2 C509.2 C514.2 C519.2 R502.2 R503.1 R507.2 R517.2 R521.2 R523.2 U500.3(IN) U501.3(IN) U502.3(IN) U503.3(IN)
EN_1.8V: R508.2 U501.7(EN)
EN_1.35V: R518.2 U502.7(EN)
EN_1V: R503.2 U500.7(EN)
EN_3.3V: R524.2 U503.7(EN)
FB_1.8V: C508.1 R506.1 R509.2 U501.1(FB)
FB_1.35V: C513.1 R516.1 R519.2 U502.1(FB)
FB_1V: C502.1 R500.1 R504.2 U500.1(FB)
FB_3.3V: C518.1 R522.1 R526.2 U503.1(FB)
JTAG-HS3_PS_NRST: CN500.14(SRST) R515.2
JTAG-HS3_TCK: CN500.6(TCK) R513.2
JTAG-HS3_TDI: CN500.10(TDI) R511.2
JTAG-HS3_TDO: CN500.8(TDO) R512.2
JTAG-HS3_TMS: CN500.4(TMS) R514.2
LED_PWR_A: LED500.4(Common_Anode) R521.1
LED_PWR_K: LED500.2(GREEN) Q500.3(D)
PG_1.8V: C510.2 R507.1 R510.2 R518.1 U501.2(PG)
PG_1.35V: C515.2 R517.1 R520.2 R524.1 U502.2(PG)
PG_1V: C505.2 R502.1 R505.2 R508.1 U500.2(PG)
PG_3.3V: C520.2 R523.1 R525.2 R527.2 U503.2(PG)
SOC_PS_I/O_21: R511.1
SOC_PS_I/O_22: R512.1
SOC_PS_I/O_23: R513.1
SOC_PS_I/O_24: R514.1
SOC_PS_I/O_48: C504.2 R501.1 R515.1 SW500.1
SW_1.8V: L501.1 U501.6(LX)
SW_1.35V: L502.1 U502.6(LX)
SW_1V: L500.1 U500.6(LX)
SW_3.3V: L503.1 U503.6(LX)
NetQ500_1: Q500.1(G) R525.1

Not connected (* = marked no-connect by the designer): CN500 12(NC)*; U500 5(NC)*; U501 5(NC)*; U502 5(NC)*; U503 5(NC)*

### Notes on the sheet
- MCU / FPGA / SOC  Test  Carrier  B'd - A (Rev.A)
- [5] FPGA / SOC  Power
- Power Sequence : +1V → +1.8V → +1.35V → +3.3V
- Vout = 0.6*(1+Rhi/Rlo) = 0.6*(1+68/100) = 1.008V
- EXT_PS_NRST
- Vout = 0.6*(1+Rhi/Rlo) = 0.6*(1+200/100) = 1.8V
- Vout = 0.6*(1+Rhi/Rlo) = 0.6*(1+124/100) = 1.344V
- Vout = 0.6*(1+Rhi/Rlo) = 0.6*(1+453/100) = 3.318V
- Title
- Rev
- Doc
- Sheet #
- of
- Author
- This document is copyright of ArkX and shall not be revealed, produced, copied, in whole or in part,
- Date
- nor used for any purpose other than submitted.
- (in symbol CON_TC2070-IDC(JTAG-HS3)) JTAG-HS3

### Library data of the parts
C500 C501 C503 C506 C507 C509 C511 C512 C514 C516 C517 C519 = CAP_22uF/25V/2012: Ceramic CAP_22uF/25V/2012; LCSC Part #: C45783; JLCPCB Part Type: Basic Part
C502 C508 C513 C518 = CAP_22pF/50V/1608: Ceramic CAP_22pF/50V/1608; LCSC Part #: C1653; JLCPCB Part Type: Basic Part
C504 = CAP_100nF/16V/1005: Ceramic CAP_100nF/16V/1005; LCSC Part #: C1525; JLCPCB Part Type: Basic Part
C505 C510 C515 = CAP_100nF/50V/1608: Ceramic CAP_100nF/50V/1608; LCSC Part #: C14663; JLCPCB Part Type: Basic Part
C520 = CAP_4.7uF/16V/1608: Ceramic CAP_4.7uF/16V/1608; LCSC Part #: C19666; JLCPCB Part Type: Basic Part
CN500 = CON_TC2070-IDC(JTAG-HS3): TC2070 14-pin Plug-of-Nails™ (with legs) to 14 pin 2mm female IDC connector.
L500-L503 = IND_2.2uH/4A/6x6: FIXED IND 2.2uH 4A 20mohm SMD; Part Name: BWVS006060282R2M00; LCSC Part #: C2838207; JLCPCB Part Type: Extended Part
LED500 = LED_MHT170RGBCT(GREEN): as LED300 on sheet 03_Power; LCSC Part #: C2962094; JLCPCB Part Type: Extended Part
Q500 = FET_2N7002: 60V 115mA 200mW 7.5Ω@10V,500mA N Channel SOT-23  MOSFETs ROHS; LCSC Part #: C8545; JLCPCB Part Type: Basic Part
R500 = RES_68K/1608/0.1W: Value: 68K; Power Rating: 0.1W; Precision: 1%; Size: 1608; LCSC Part #: C23231; JLCPCB Part Type: Basic Part
R501 = RES_10K/1005/62.5mW: Value: 10K; Power Rating: 62.5mW; Precision: 1%; Size: 1005; LCSC Part #: C25744; JLCPCB Part Type: Basic Part
R502 R503 R507 R508 R517 R518 R523-R525 = RES_12K/1608/0.1W: Value: 12K; Power Rating: 0.1W; Precision: 1%; Size: 1608; LCSC Part #: C22790; JLCPCB Part Type: Basic Part
R504 R505 R509 R510 R519 R520 R526 R527 = RES_100K/1608/0.1W: Value: 100K; Power Rating: 0.1W; Precision: 1%; Size: 1608; LCSC Part #: C25803; JLCPCB Part Type: Basic Part
R506 = RES_200K/1608/0.1W: Value: 200K; Power Rating: 0.1W; Precision: 1%; Size: 1608; LCSC Part #: C25811; JLCPCB Part Type: Basic Part
R511-R515 = RES_0R/1005/62.5mW: Value: 0R; Power Rating: 62.5mW; Precision: 1%; Size: 1005; LCSC Part #: C17168; JLCPCB Part Type: Basic Part
R516 = RES_124K/1608/0.1W: Value: 124K; Power Rating: 0.1W; Precision: 1%; Size: 1608; LCSC Part #: C140118; JLCPCB Part Type: Extended Part
R521 = RES_510R/2012/0.125W: Value: 510R; Power Rating: 0.125W; Precision: 1%; Size: 2012; LCSC Part #: C17734; JLCPCB Part Type: Basic Part
R522 = RES_453K/1608/0.1W: Value: 453K; Power Rating: 0.1W; Precision: 1%; Size: 1608; LCSC Part #: C25818; JLCPCB Part Type: Extended Part
SW500 = SW_K2-1102SP-C4SC-04(2P): -25℃~+85℃ 6mm 5mm Round Button 50mA Brick nogging 6mm SPST 100MΩ 100000 250gf@±30gf 12V SMD  Tactile Switches ROHS; LCSC Part #: C127509; JLCPCB Part Type: Extended Part
U500-U503 = IC_REG_SY8003ADFC: High Efficiency 5.5V, 3A Continuous, 1MHz Synchronous Step Down Regulator; Manufacturer: Silergy; Manufacturer Part Number: High Efficiency 5.5V, 3A continuous, 1MHz; JLCPCB Part Type: Extended Part; LCSC Part #: C178236

## Sheet 06_FPGA_SOC_Part2.SchDoc
size A3; SheetNumber: 6; SheetTotal: 8
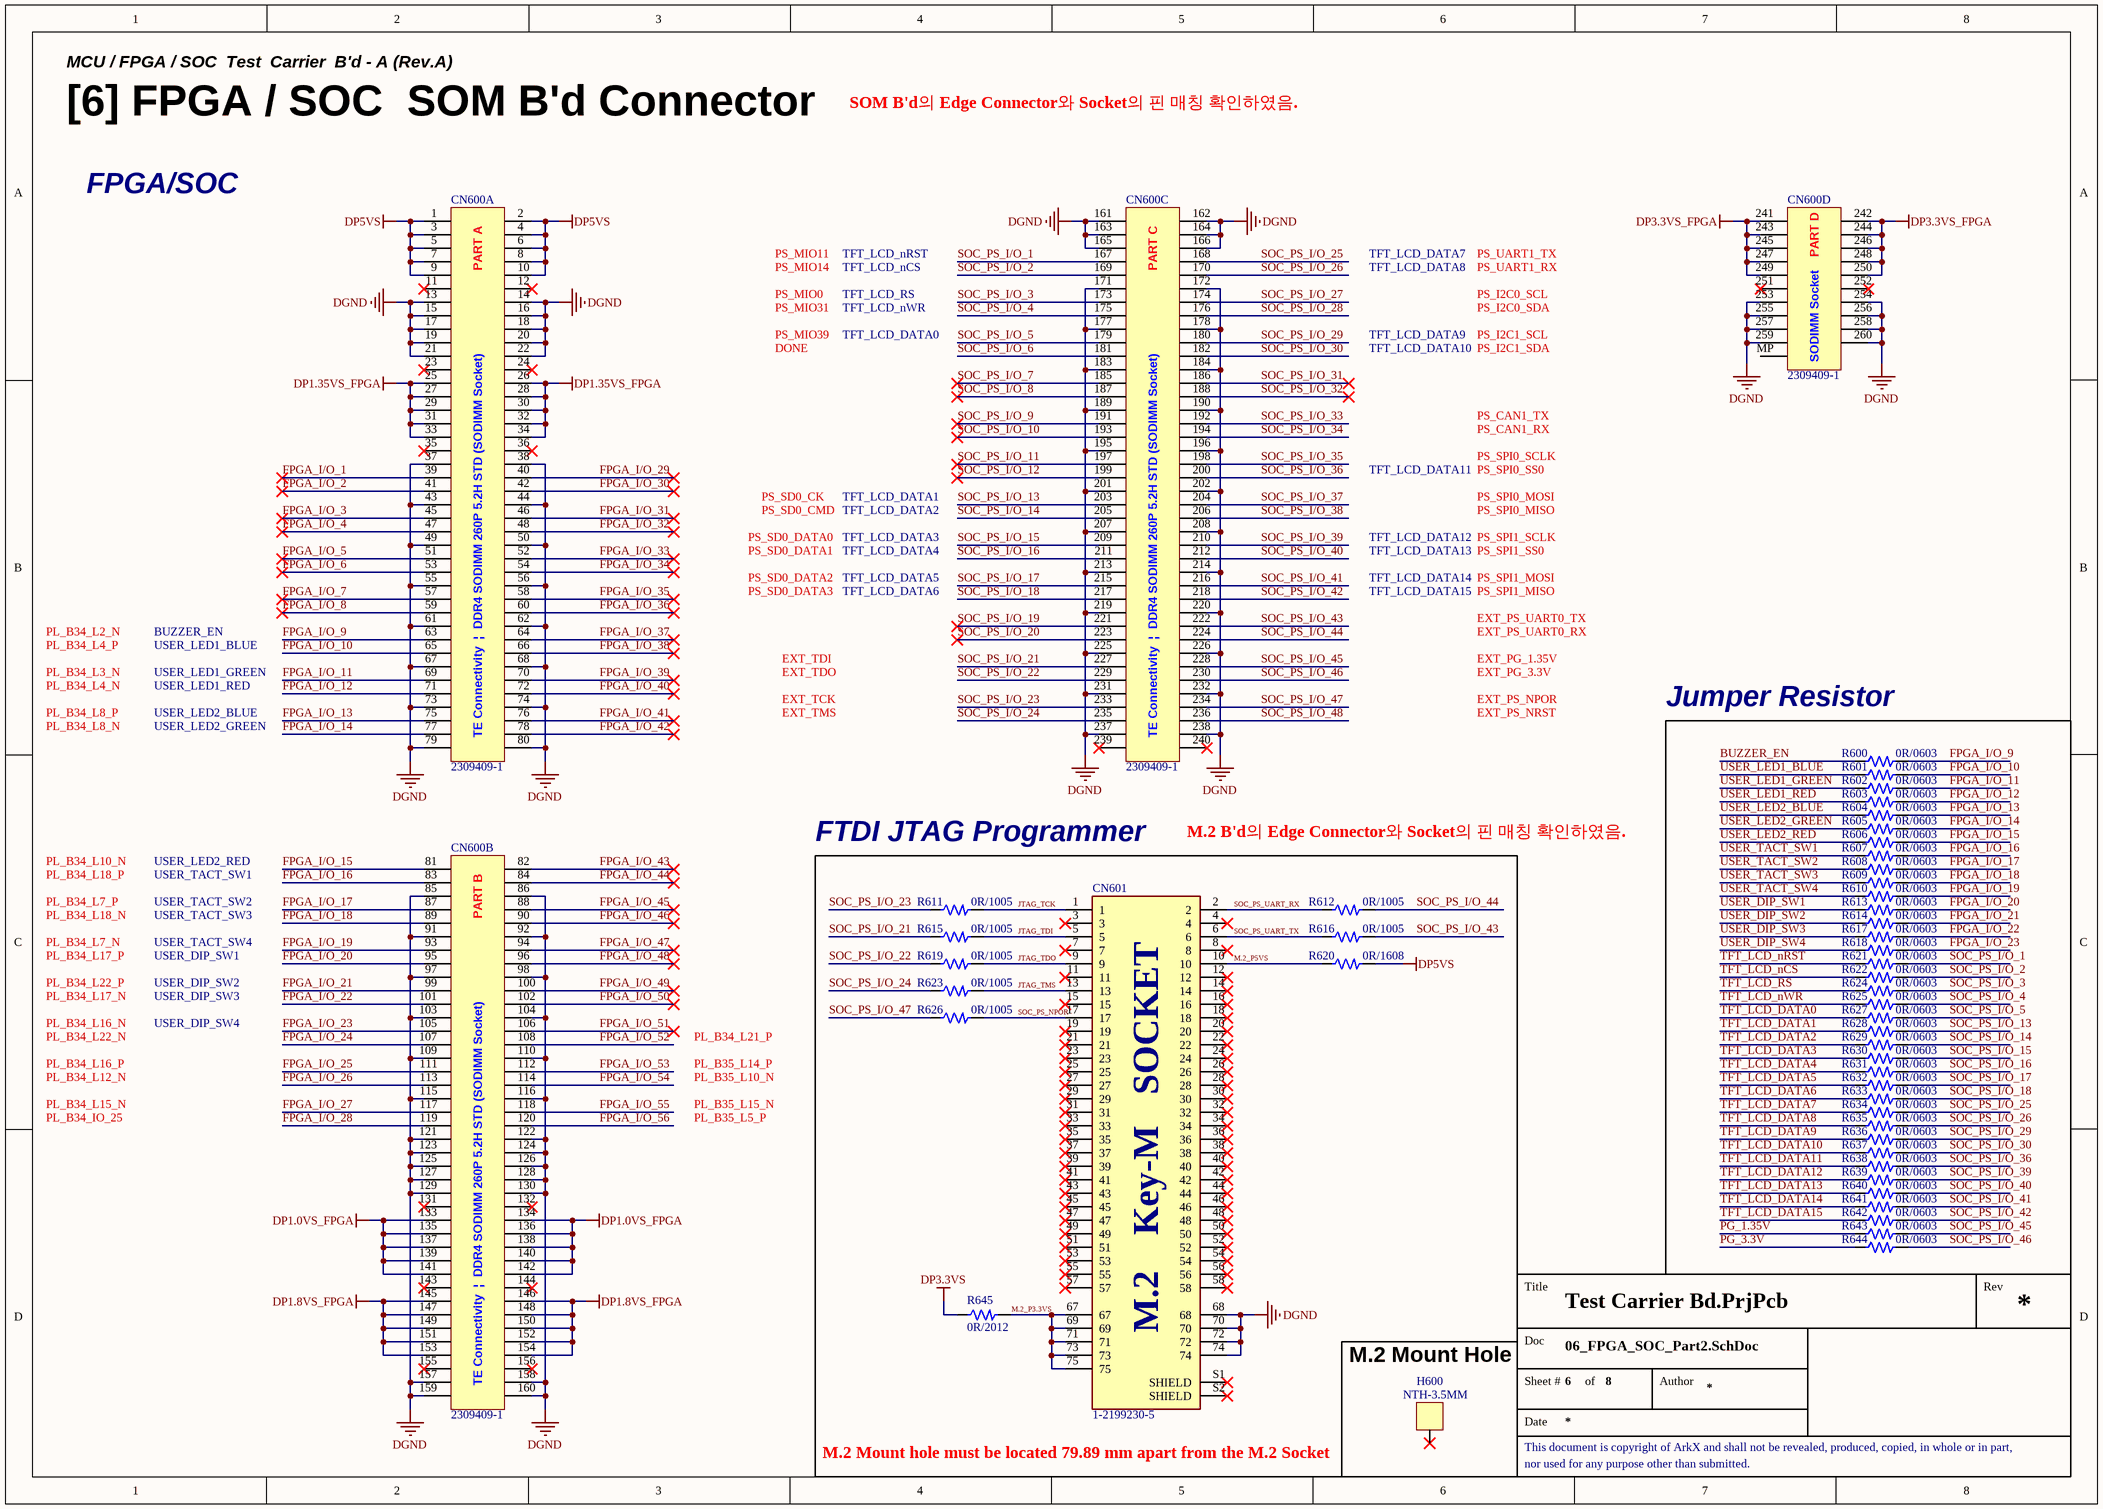
[diagram p5: 06_FPGA_SOC_Part2.SchDoc]

### Parts
CN600  2309409-1  [CON_SODIMM_2309409-1]  (parts A,B,C,D of 4)
CN601  1-2199230-5  [CON_M.2-KEY-M_FEMALE_1-2199230-5]
H600  NTH-3.5MM  [HOLE_NTH-3.5MM]
R600  0R/0603  [RES 0603 (0201_inch)]
R601  0R/0603  [RES 0603 (0201_inch)]
R602  0R/0603  [RES 0603 (0201_inch)]
R603  0R/0603  [RES 0603 (0201_inch)]
R604  0R/0603  [RES 0603 (0201_inch)]
R605  0R/0603  [RES 0603 (0201_inch)]
R606  0R/0603  [RES 0603 (0201_inch)]
R607  0R/0603  [RES 0603 (0201_inch)]
R608  0R/0603  [RES 0603 (0201_inch)]
R609  0R/0603  [RES 0603 (0201_inch)]
R610  0R/0603  [RES 0603 (0201_inch)]
R611  0R/1005  [RES 1005 (0402_inch)]
R612  0R/1005  [RES 1005 (0402_inch)]
R613  0R/0603  [RES 0603 (0201_inch)]
R614  0R/0603  [RES 0603 (0201_inch)]
R615  0R/1005  [RES 1005 (0402_inch)]
R616  0R/1005  [RES 1005 (0402_inch)]
R617  0R/0603  [RES 0603 (0201_inch)]
R618  0R/0603  [RES 0603 (0201_inch)]
R619  0R/1005  [RES 1005 (0402_inch)]
R620  0R/1608  [RES 1608 (0603_inch)]
R621  0R/0603  [RES 0603 (0201_inch)]
R622  0R/0603  [RES 0603 (0201_inch)]
R623  0R/1005  [RES 1005 (0402_inch)]
R624  0R/0603  [RES 0603 (0201_inch)]
R625  0R/0603  [RES 0603 (0201_inch)]
R626  0R/1005  [RES 1005 (0402_inch)]
R627  0R/0603  [RES 0603 (0201_inch)]
R628  0R/0603  [RES 0603 (0201_inch)]
R629  0R/0603  [RES 0603 (0201_inch)]
R630  0R/0603  [RES 0603 (0201_inch)]
R631  0R/0603  [RES 0603 (0201_inch)]
R632  0R/0603  [RES 0603 (0201_inch)]
R633  0R/0603  [RES 0603 (0201_inch)]
R634  0R/0603  [RES 0603 (0201_inch)]
R635  0R/0603  [RES 0603 (0201_inch)]
R636  0R/0603  [RES 0603 (0201_inch)]
R637  0R/0603  [RES 0603 (0201_inch)]
R638  0R/0603  [RES 0603 (0201_inch)]
R639  0R/0603  [RES 0603 (0201_inch)]
R640  0R/0603  [RES 0603 (0201_inch)]
R641  0R/0603  [RES 0603 (0201_inch)]
R642  0R/0603  [RES 0603 (0201_inch)]
R643  0R/0603  [RES 0603 (0201_inch)]
R644  0R/0603  [RES 0603 (0201_inch)]
R645  0R/2012  [RES 2012 (0805_inch)]

### Blocks framed on the sheet
Jumper Resistor: R600-R610 R613 R614 R617 R618 R621 R622 R624 R625 R627-R644
FTDI JTAG Programmer: CN601 R611 R612 R615 R616 R619 R620 R623 R626 R645
M.2 Mount Hole: H600

### Nets
DGND: CN600.13 CN600.14 CN600.15 CN600.16 CN600.17 CN600.18 CN600.19 CN600.20 CN600.21 CN600.22 CN600.37 CN600.38 CN600.43 CN600.44 CN600.49 CN600.50 CN600.55 CN600.56 CN600.61 CN600.62 CN600.67 CN600.68 CN600.73 CN600.74 CN600.79 CN600.80 CN600.85 CN600.86 CN600.91 CN600.92 CN600.97 CN600.98 CN600.103 CN600.104 CN600.109 CN600.110 CN600.115 CN600.116 CN600.121 CN600.122 CN600.123 CN600.124 CN600.125 CN600.126 CN600.127 CN600.128 CN600.129 CN600.130 CN600.157 CN600.158 CN600.159 CN600.160 CN600.161 CN600.162 CN600.163 CN600.164 CN600.165 CN600.166 CN600.171 CN600.172 CN600.177 CN600.178 CN600.183 CN600.184 CN600.189 CN600.190 CN600.195 CN600.196 CN600.201 CN600.202 CN600.207 CN600.208 CN600.213 CN600.214 CN600.219 CN600.220 CN600.225 CN600.226 CN600.231 CN600.232 CN600.237 CN600.238 CN600.253 CN600.254 CN600.255 CN600.256 CN600.257 CN600.258 CN600.259 CN600.260 CN601.68 CN601.70 CN601.72 CN601.74
DP1.0VS_FPGA: CN600.133 CN600.134 CN600.135 CN600.136 CN600.137 CN600.138 CN600.139 CN600.140 CN600.141 CN600.142
DP1.8VS_FPGA: CN600.145 CN600.146 CN600.147 CN600.148 CN600.149 CN600.150 CN600.151 CN600.152 CN600.153 CN600.154
DP1.35VS_FPGA: CN600.25 CN600.26 CN600.27 CN600.28 CN600.29 CN600.30 CN600.31 CN600.32 CN600.33 CN600.34
DP3.3VS: R645.1
DP3.3VS_FPGA: CN600.241 CN600.242 CN600.243 CN600.244 CN600.245 CN600.246 CN600.247 CN600.248 CN600.249 CN600.250
DP5VS: CN600.1 CN600.2 CN600.3 CN600.4 CN600.5 CN600.6 CN600.7 CN600.8 CN600.9 CN600.10 R620.2
BUZZER_EN: R600.1
FPGA_I/O_1: CN600.39
FPGA_I/O_2: CN600.41
FPGA_I/O_3: CN600.45
FPGA_I/O_4: CN600.47
FPGA_I/O_5: CN600.51
FPGA_I/O_6: CN600.53
FPGA_I/O_7: CN600.57
FPGA_I/O_8: CN600.59
FPGA_I/O_9: CN600.63 R600.2
FPGA_I/O_10: CN600.65 R601.2
FPGA_I/O_11: CN600.69 R602.2
FPGA_I/O_12: CN600.71 R603.2
FPGA_I/O_13: CN600.75 R604.2
FPGA_I/O_14: CN600.77 R605.2
FPGA_I/O_15: CN600.81 R606.2
FPGA_I/O_16: CN600.83 R607.2
FPGA_I/O_17: CN600.87 R608.2
FPGA_I/O_18: CN600.89 R609.2
FPGA_I/O_19: CN600.93 R610.2
FPGA_I/O_20: CN600.95 R613.2
FPGA_I/O_21: CN600.99 R614.2
FPGA_I/O_22: CN600.101 R617.2
FPGA_I/O_23: CN600.105 R618.2
FPGA_I/O_24: CN600.107
FPGA_I/O_25: CN600.111
FPGA_I/O_26: CN600.113
FPGA_I/O_27: CN600.117
FPGA_I/O_28: CN600.119
FPGA_I/O_29: CN600.40
FPGA_I/O_30: CN600.42
FPGA_I/O_31: CN600.46
FPGA_I/O_32: CN600.48
FPGA_I/O_33: CN600.52
FPGA_I/O_34: CN600.54
FPGA_I/O_35: CN600.58
FPGA_I/O_36: CN600.60
FPGA_I/O_37: CN600.64
FPGA_I/O_38: CN600.66
FPGA_I/O_39: CN600.70
FPGA_I/O_40: CN600.72
FPGA_I/O_41: CN600.76
FPGA_I/O_42: CN600.78
FPGA_I/O_43: CN600.82
FPGA_I/O_44: CN600.84
FPGA_I/O_45: CN600.88
FPGA_I/O_46: CN600.90
FPGA_I/O_47: CN600.94
FPGA_I/O_48: CN600.96
FPGA_I/O_49: CN600.100
FPGA_I/O_50: CN600.102
FPGA_I/O_51: CN600.106
FPGA_I/O_52: CN600.108
FPGA_I/O_53: CN600.112
FPGA_I/O_54: CN600.114
FPGA_I/O_55: CN600.118
FPGA_I/O_56: CN600.120
JTAG_TCK: CN601.1 R611.2
JTAG_TDI: CN601.5 R615.2
JTAG_TDO: CN601.9 R619.2
JTAG_TMS: CN601.13 R623.2
M.2_P3.3VS: CN601.67 CN601.69 CN601.71 CN601.73 CN601.75 R645.2
M.2_P5VS: CN601.10 R620.1
PG_1.35V: R643.1
PG_3.3V: R644.1
SOC_PS_I/O_1: CN600.167 R621.2
SOC_PS_I/O_2: CN600.169 R622.2
SOC_PS_I/O_3: CN600.173 R624.2
SOC_PS_I/O_4: CN600.175 R625.2
SOC_PS_I/O_5: CN600.179 R627.2
SOC_PS_I/O_6: CN600.181
SOC_PS_I/O_7: CN600.185
SOC_PS_I/O_8: CN600.187
SOC_PS_I/O_9: CN600.191
SOC_PS_I/O_10: CN600.193
SOC_PS_I/O_11: CN600.197
SOC_PS_I/O_12: CN600.199
SOC_PS_I/O_13: CN600.203 R628.2
SOC_PS_I/O_14: CN600.205 R629.2
SOC_PS_I/O_15: CN600.209 R630.2
SOC_PS_I/O_16: CN600.211 R631.2
SOC_PS_I/O_17: CN600.215 R632.2
SOC_PS_I/O_18: CN600.217 R633.2
SOC_PS_I/O_19: CN600.221
SOC_PS_I/O_20: CN600.223
SOC_PS_I/O_21: CN600.227 R615.1
SOC_PS_I/O_22: CN600.229 R619.1
SOC_PS_I/O_23: CN600.233 R611.1
SOC_PS_I/O_24: CN600.235 R623.1
SOC_PS_I/O_25: CN600.168 R634.2
SOC_PS_I/O_26: CN600.170 R635.2
SOC_PS_I/O_27: CN600.174
SOC_PS_I/O_28: CN600.176
SOC_PS_I/O_29: CN600.180 R636.2
SOC_PS_I/O_30: CN600.182 R637.2
SOC_PS_I/O_31: CN600.186
SOC_PS_I/O_32: CN600.188
SOC_PS_I/O_33: CN600.192
SOC_PS_I/O_34: CN600.194
SOC_PS_I/O_35: CN600.198
SOC_PS_I/O_36: CN600.200 R638.2
SOC_PS_I/O_37: CN600.204
SOC_PS_I/O_38: CN600.206
SOC_PS_I/O_39: CN600.210 R639.2
SOC_PS_I/O_40: CN600.212 R640.2
SOC_PS_I/O_41: CN600.216 R641.2
SOC_PS_I/O_42: CN600.218 R642.2
SOC_PS_I/O_43: CN600.222 R616.2
SOC_PS_I/O_44: CN600.224 R612.2
SOC_PS_I/O_45: CN600.228 R643.2
SOC_PS_I/O_46: CN600.230 R644.2
SOC_PS_I/O_47: CN600.234 R626.1
SOC_PS_I/O_48: CN600.236
SOC_PS_NPOR: CN601.17 R626.2
SOC_PS_UART_RX: CN601.2 R612.1
SOC_PS_UART_TX: CN601.6 R616.1
TFT_LCD_DATA0: R627.1
TFT_LCD_DATA1: R628.1
TFT_LCD_DATA2: R629.1
TFT_LCD_DATA3: R630.1
TFT_LCD_DATA4: R631.1
TFT_LCD_DATA5: R632.1
TFT_LCD_DATA6: R633.1
TFT_LCD_DATA7: R634.1
TFT_LCD_DATA8: R635.1
TFT_LCD_DATA9: R636.1
TFT_LCD_DATA10: R637.1
TFT_LCD_DATA11: R638.1
TFT_LCD_DATA12: R639.1
TFT_LCD_DATA13: R640.1
TFT_LCD_DATA14: R641.1
TFT_LCD_DATA15: R642.1
TFT_LCD_nCS: R622.1
TFT_LCD_nRST: R621.1
TFT_LCD_nWR: R625.1
TFT_LCD_RS: R624.1
USER_DIP_SW1: R613.1
USER_DIP_SW2: R614.1
USER_DIP_SW3: R617.1
USER_DIP_SW4: R618.1
USER_LED1_BLUE: R601.1
USER_LED1_GREEN: R602.1
USER_LED1_RED: R603.1
USER_LED2_BLUE: R604.1
USER_LED2_GREEN: R605.1
USER_LED2_RED: R606.1
USER_TACT_SW1: R607.1
USER_TACT_SW2: R608.1
USER_TACT_SW3: R609.1
USER_TACT_SW4: R610.1

Not connected (* = marked no-connect by the designer): CN600 11* 12* 23* 24* 35* 36* 131* 132* 143* 144* 155* 156* 239* 240* 251* 252* MP; CN601 3* 4* 7* 8* 11* 12* 14* 15* 16* 18* 19* 20* 21* 22* 23* 24* 25* 26* 27* 28* 29* 30* 31* 32* 33* 34* 35* 36* 37* 38* 39* 40* 41* 42* 43* 44* 45* 46* 47* 48* 49* 50* 51* 52* 53* 54* 55* 56* 57* 58* S1(SHIELD)* S2(SHIELD)*; H600 1*

### Notes on the sheet
- MCU / FPGA / SOC  Test  Carrier  B'd - A (Rev.A)
- SOM B'd의 Edge Connector와 Socket의 핀 매칭 확인하였음.
- [6] FPGA / SOC  SOM B'd Connector
- FPGA/SOC
- PS_MIO11
- PS_MIO14
- PS_MIO0
- PS_MIO31
- TFT_LCD_nRST
- TFT_LCD_nCS
- TFT_LCD_RS
- TFT_LCD_nWR
- TFT_LCD_DATA7
- TFT_LCD_DATA8
- PS_UART1_TX
- PS_UART1_RX
- PS_I2C0_SCL
- PS_I2C0_SDA
- PS_MIO39
- DONE
- TFT_LCD_DATA0
- TFT_LCD_DATA9
- TFT_LCD_DATA10
- PS_I2C1_SCL
- PS_I2C1_SDA
- PS_CAN1_TX
- PS_CAN1_RX
- PS_SD0_CK
- PS_SD0_CMD
- TFT_LCD_DATA1
- TFT_LCD_DATA2
- TFT_LCD_DATA11
- PS_SPI0_SCLK
- PS_SPI0_SS0
- PS_SPI0_MOSI
- PS_SPI0_MISO
- PS_SD0_DATA0
- PS_SD0_DATA1
- PS_SD0_DATA2
- TFT_LCD_DATA3
- TFT_LCD_DATA4
- TFT_LCD_DATA5
- TFT_LCD_DATA12
- TFT_LCD_DATA13
- TFT_LCD_DATA14
- PS_SPI1_SCLK
- PS_SPI1_SS0
- PS_SPI1_MOSI
- PL_B34_L2_N
- PL_B34_L4_P
- BUZZER_EN
- USER_LED1_BLUE
- PS_SD0_DATA3
- TFT_LCD_DATA6
- TFT_LCD_DATA15
- PS_SPI1_MISO
- EXT_PS_UART0_TX
- EXT_PS_UART0_RX
- PL_B34_L3_N
- PL_B34_L4_N
- PL_B34_L8_P
- USER_LED1_GREEN
- USER_LED1_RED
- USER_LED2_BLUE
- EXT_TDI
- EXT_TDO
- EXT_TCK
- EXT_TMS
- EXT_PG_1.35V
- EXT_PG_3.3V
- EXT_PS_NPOR
- EXT_PS_NRST
- PL_B34_L8_N
- USER_LED2_GREEN
- M.2 B'd의 Edge Connector와 Socket의 핀 매칭 확인하였음.
- PL_B34_L10_N
- PL_B34_L18_P
- PL_B34_L7_P
- PL_B34_L18_N
- USER_LED2_RED
- USER_TACT_SW1
- USER_TACT_SW2
- USER_TACT_SW3
- PL_B34_L7_N
- PL_B34_L17_P
- PL_B34_L22_P
- USER_TACT_SW4
- USER_DIP_SW1
- USER_DIP_SW2
- PL_B34_L17_N
- PL_B34_L16_N
- PL_B34_L22_N
- USER_DIP_SW3
- USER_DIP_SW4
- PL_B34_L21_P
- PL_B34_L16_P
- PL_B34_L12_N
- PL_B34_L15_N
- PL_B34_IO_25
- PL_B35_L14_P
- PL_B35_L10_N
- PL_B35_L15_N
- PL_B35_L5_P
- M.2 Mount hole must be located 79.89 mm apart from the M.2 Socket
- Title
- Rev
- Doc
- Sheet #
- of
- Author
- This document is copyright of ArkX and shall not be revealed, produced, copied, in whole or in part,
- Date
- nor used for any purpose other than submitted.
- (in symbol CON_M.2-KEY-M_FEMALE_1-2199230-5) SOCKET; Key-M; M.2
- (in symbol CON_SODIMM_2309409-1, part A) PART A; TE Connectivity  |  DDR4 SODIMM 260P 5.2H STD (SODIMM Socket)
- (in symbol CON_SODIMM_2309409-1, part B) PART B; TE Connectivity  |  DDR4 SODIMM 260P 5.2H STD (SODIMM Socket)
- (in symbol CON_SODIMM_2309409-1, part C) PART C; TE Connectivity  |  DDR4 SODIMM 260P 5.2H STD (SODIMM Socket)
- (in symbol CON_SODIMM_2309409-1, part D) PART D; SODIMM Socket

### Library data of the parts
CN600 = CON_SODIMM_2309409-1: as CN400 on sheet 04_MCU_Part; Manufacturer Part Number: 2309409-1; JLCPCB Part Type: Extended Part; LCSC Part #: C5164025
CN601 = CON_M.2-KEY-M_FEMALE_1-2199230-5: M.2 NGFF Key M Card Edge Connector 0.5mm Pitch 67 Position 4.2mm Height; Manufacturer: TE Connectivity; Manufacturer Part Number: 1-2199230-5; Distributor Link: https://eu.mouser.com/ProductDetail/TE-Connectivity/1-2199230-5?qs=N0TJGnUfxCD5L9UvFjPEwQ%3D%3D; LCSC Part #: C590854; JLCPCB Part Type: Extended Part
H600 = HOLE_NTH-3.5MM: Non-Through Hole 3.5mm
R600-R610 R613 R614 R617 R618 R621 R622 R624 R625 R627-R644 = RES_0R/0603/50mW: as R400 on sheet 04_MCU_Part; Size: 0603; Power Rating: 50mW; Precision: 1%; LCSC Part #: C106227; JLCPCB Part Type: Extended Part
R611 R612 R615 R616 R619 R623 R626 = RES_0R/1005/62.5mW: as R511 on sheet 05_FPGA_SOC_Part1; Size: 1005; LCSC Part #: C17168; JLCPCB Part Type: Basic Part
R620 = RES_0R/1608/0.1W: Value: 0R; Power Rating: 0.1W; Precision: 1%; Size: 1608; LCSC Part #: C21189; JLCPCB Part Type: Basic Part
R645 = RES_0R/2012/0.125W: Value: 0R; Power Rating: 0.125W; Precision: 1%; Size: 2012; LCSC Part #: C17477; JLCPCB Part Type: Basic Part

## Sheet 07_Peripheral_Part.SchDoc
size A3; SheetNumber: 7; SheetTotal: 8
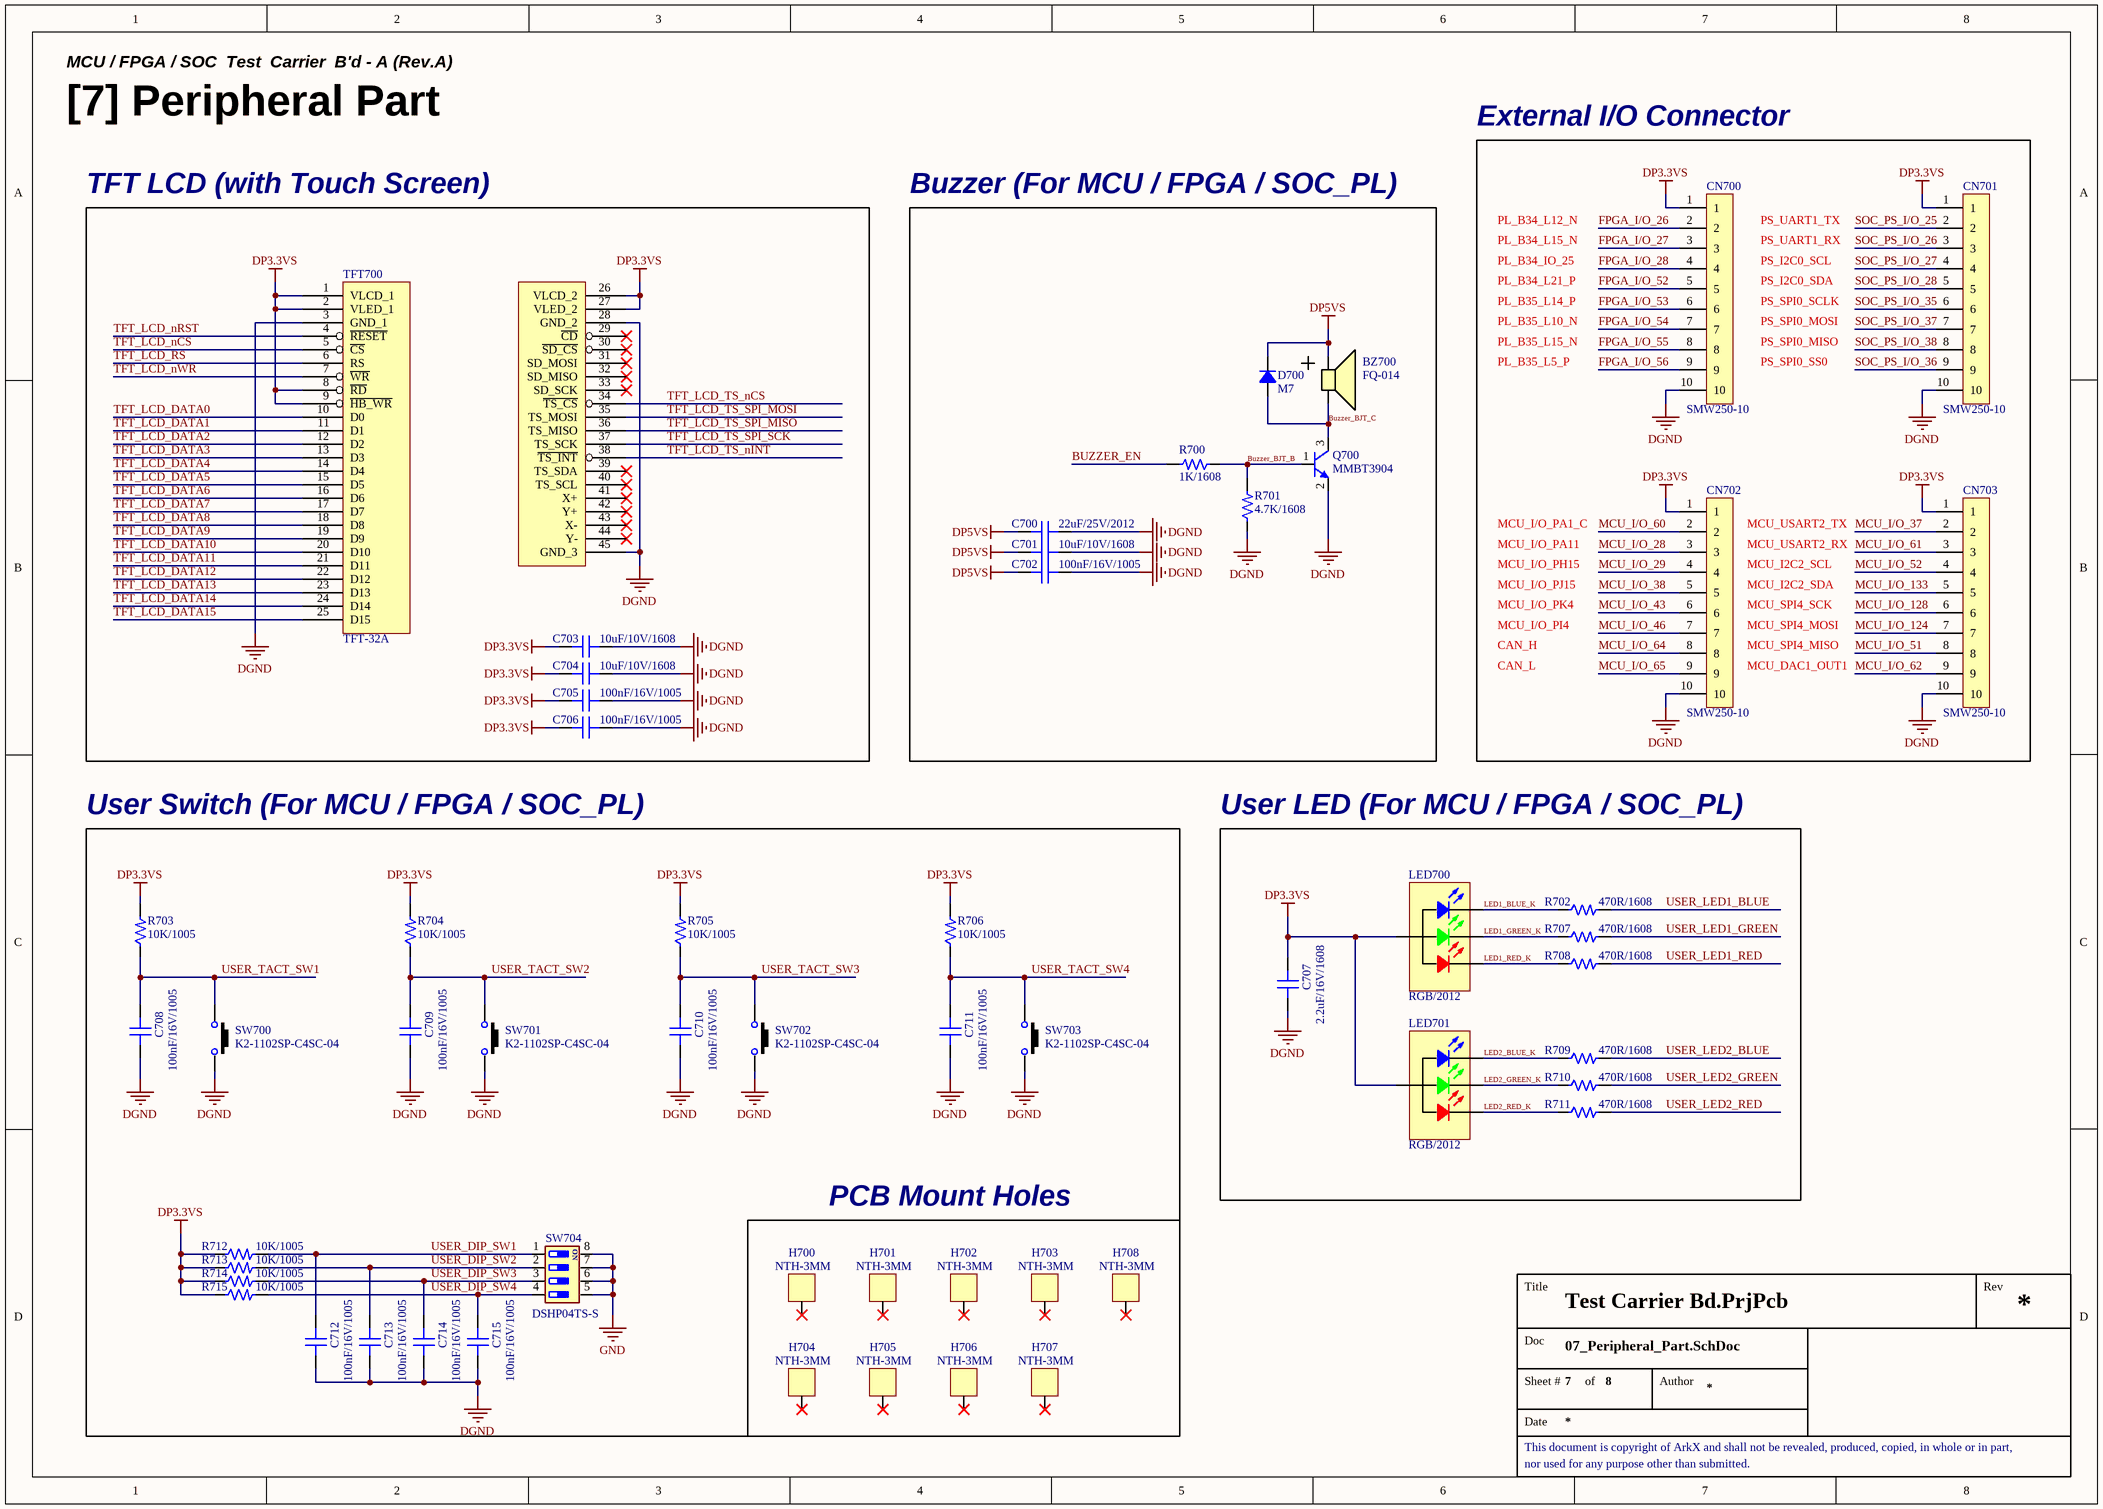
[diagram p6: 07_Peripheral_Part.SchDoc]

### Parts
BZ700  FQ-014  [BUZ FQ-013]
C700  22uF/25V/2012  [CAP 2012 (0805_INCH)]
C701  10uF/10V/1608  [CAP 1608 (0603_INCH)]
C702  100nF/16V/1005  [CAP 1005 (0402_INCH)]
C703  10uF/10V/1608  [CAP 1608 (0603_INCH)]
C704  10uF/10V/1608  [CAP 1608 (0603_INCH)]
C705  100nF/16V/1005  [CAP 1005 (0402_INCH)]
C706  100nF/16V/1005  [CAP 1005 (0402_INCH)]
C707  2.2uF/16V/1608  [CAP 1608 (0603_INCH)]
C708  100nF/16V/1005  [CAP 1005 (0402_INCH)]
C709  100nF/16V/1005  [CAP 1005 (0402_INCH)]
C710  100nF/16V/1005  [CAP 1005 (0402_INCH)]
C711  100nF/16V/1005  [CAP 1005 (0402_INCH)]
C712  100nF/16V/1005  [CAP 1005 (0402_INCH)]
C713  100nF/16V/1005  [CAP 1005 (0402_INCH)]
C714  100nF/16V/1005  [CAP 1005 (0402_INCH)]
C715  100nF/16V/1005  [CAP 1005 (0402_INCH)]
CN700  SMW250-10  [CON_SMW250-10]
CN701  SMW250-10  [CON_SMW250-10]
CN702  SMW250-10  [CON_SMW250-10]
CN703  SMW250-10  [CON_SMW250-10]
D700  M7  [DIO DO-214AC (SMA)]
H700  NTH-3MM  [HOLE_NTH-3.0MM]
H701  NTH-3MM  [HOLE_NTH-3.0MM]
H702  NTH-3MM  [HOLE_NTH-3.0MM]
H703  NTH-3MM  [HOLE_NTH-3.0MM]
H704  NTH-3MM  [HOLE_NTH-3.0MM]
H705  NTH-3MM  [HOLE_NTH-3.0MM]
H706  NTH-3MM  [HOLE_NTH-3.0MM]
H707  NTH-3MM  [HOLE_NTH-3.0MM]
H708  NTH-3MM  [HOLE_NTH-3.0MM]
LED700  RGB/2012  [LED MHT170RGBCT]
LED701  RGB/2012  [LED MHT170RGBCT]
Q700  MMBT3904  [SOT 23-3 (DIODES INCORPORATED)]
R700  1K/1608  [RES 1608 (0603_inch)]
R701  4.7K/1608  [RES 1608 (0603_inch)]
R702  470R/1608  [RES 1608 (0603_inch)]
R703  10K/1005  [RES 1005 (0402_inch)]
R704  10K/1005  [RES 1005 (0402_inch)]
R705  10K/1005  [RES 1005 (0402_inch)]
R706  10K/1005  [RES 1005 (0402_inch)]
R707  470R/1608  [RES 1608 (0603_inch)]
R708  470R/1608  [RES 1608 (0603_inch)]
R709  470R/1608  [RES 1608 (0603_inch)]
R710  470R/1608  [RES 1608 (0603_inch)]
R711  470R/1608  [RES 1608 (0603_inch)]
R712  10K/1005  [RES 1005 (0402_inch)]
R713  10K/1005  [RES 1005 (0402_inch)]
R714  10K/1005  [RES 1005 (0402_inch)]
R715  10K/1005  [RES 1005 (0402_inch)]
SW700  K2-1102SP-C4SC-04  [SW K2-1102SP-C4SC-04]
SW701  K2-1102SP-C4SC-04  [SW K2-1102SP-C4SC-04]
SW702  K2-1102SP-C4SC-04  [SW K2-1102SP-C4SC-04]
SW703  K2-1102SP-C4SC-04  [SW K2-1102SP-C4SC-04]
SW704  DSHP04TS-S  [SW_DSHP04TS-S]
TFT700  TFT-32A  [LCD_TFT-32A]

### Blocks framed on the sheet
External I/O Connector: CN700-CN703
TFT LCD (with Touch Screen): C703-C706 TFT700
Buzzer (For MCU / FPGA / SOC_PL): BZ700 C700-C702 D700 Q700 R700 R701
User Switch (For MCU / FPGA / SOC_PL): C708-C715 R703-R706 R712-R715 SW700-SW704
User LED (For MCU / FPGA / SOC_PL): C707 LED700 LED701 R702 R707-R711
PCB Mount Holes: H700-H708

### Nets
DGND: C700.2 C701.1 C702.1 C703.1 C704.1 C705.1 C706.1 C707.2 C708.1 C709.1 C710.1 C711.1 C712.1 C713.1 C714.1 C715.1 CN700.10 CN701.10 CN702.10 CN703.10 Q700.2(E) R701.1 SW700.3 SW701.3 SW702.3 SW703.3 TFT700.3(GND_1) TFT700.28(GND_2) TFT700.45(GND_3)
DP3.3VS: C703.2 C704.2 C705.2 C706.2 C707.1 CN700.1 CN701.1 CN702.1 CN703.1 LED700.4(Common_Anode) LED701.4(Common_Anode) R703.2 R704.2 R705.2 R706.2 R712.1 R713.1 R714.1 R715.1 TFT700.1(VLCD_1) TFT700.2(VLED_1) TFT700.8(~{RD}) TFT700.9(~{HB_WR}) TFT700.26(VLCD_2) TFT700.27(VLED_2)
DP5VS: BZ700.1 C700.1 C701.2 C702.2 D700.2
GND: SW704.5 SW704.6 SW704.7 SW704.8
Buzzer_BJT_B: Q700.1(B) R700.1 R701.2
Buzzer_BJT_C: BZ700.2 D700.1 Q700.3(C)
BUZZER_EN: R700.2
FPGA_I/O_26: CN700.2
FPGA_I/O_27: CN700.3
FPGA_I/O_28: CN700.4
FPGA_I/O_52: CN700.5
FPGA_I/O_53: CN700.6
FPGA_I/O_54: CN700.7
FPGA_I/O_55: CN700.8
FPGA_I/O_56: CN700.9
LED1_BLUE_K: LED700.3(BLUE) R702.1
LED1_GREEN_K: LED700.2(GREEN) R707.1
LED1_RED_K: LED700.1(RED) R708.1
LED2_BLUE_K: LED701.3(BLUE) R709.1
LED2_GREEN_K: LED701.2(GREEN) R710.1
LED2_RED_K: LED701.1(RED) R711.1
MCU_I/O_28: CN702.3
MCU_I/O_29: CN702.4
MCU_I/O_37: CN703.2
MCU_I/O_38: CN702.5
MCU_I/O_43: CN702.6
MCU_I/O_46: CN702.7
MCU_I/O_51: CN703.8
MCU_I/O_52: CN703.4
MCU_I/O_60: CN702.2
MCU_I/O_61: CN703.3
MCU_I/O_62: CN703.9
MCU_I/O_64: CN702.8
MCU_I/O_65: CN702.9
MCU_I/O_124: CN703.7
MCU_I/O_128: CN703.6
MCU_I/O_133: CN703.5
SOC_PS_I/O_25: CN701.2
SOC_PS_I/O_26: CN701.3
SOC_PS_I/O_27: CN701.4
SOC_PS_I/O_28: CN701.5
SOC_PS_I/O_35: CN701.6
SOC_PS_I/O_36: CN701.9
SOC_PS_I/O_37: CN701.7
SOC_PS_I/O_38: CN701.8
TFT_LCD_DATA0: TFT700.10(D0)
TFT_LCD_DATA1: TFT700.11(D1)
TFT_LCD_DATA2: TFT700.12(D2)
TFT_LCD_DATA3: TFT700.13(D3)
TFT_LCD_DATA4: TFT700.14(D4)
TFT_LCD_DATA5: TFT700.15(D5)
TFT_LCD_DATA6: TFT700.16(D6)
TFT_LCD_DATA7: TFT700.17(D7)
TFT_LCD_DATA8: TFT700.18(D8)
TFT_LCD_DATA9: TFT700.19(D9)
TFT_LCD_DATA10: TFT700.20(D10)
TFT_LCD_DATA11: TFT700.21(D11)
TFT_LCD_DATA12: TFT700.22(D12)
TFT_LCD_DATA13: TFT700.23(D13)
TFT_LCD_DATA14: TFT700.24(D14)
TFT_LCD_DATA15: TFT700.25(D15)
TFT_LCD_nCS: TFT700.5(~{CS})
TFT_LCD_nRST: TFT700.4(~{RESET})
TFT_LCD_nWR: TFT700.7(~{WR})
TFT_LCD_RS: TFT700.6(RS)
TFT_LCD_TS_nCS: TFT700.34(~{TS_CS})
TFT_LCD_TS_nINT: TFT700.38(~{TS_INT})
TFT_LCD_TS_SPI_MISO: TFT700.36(TS_MISO)
TFT_LCD_TS_SPI_MOSI: TFT700.35(TS_MOSI)
TFT_LCD_TS_SPI_SCK: TFT700.37(TS_SCK)
USER_DIP_SW1: C712.2 R712.2 SW704.1
USER_DIP_SW2: C713.2 R713.2 SW704.2
USER_DIP_SW3: C714.2 R714.2 SW704.3
USER_DIP_SW4: C715.2 R715.2 SW704.4
USER_LED1_BLUE: R702.2
USER_LED1_GREEN: R707.2
USER_LED1_RED: R708.2
USER_LED2_BLUE: R709.2
USER_LED2_GREEN: R710.2
USER_LED2_RED: R711.2
USER_TACT_SW1: C708.2 R703.1 SW700.1
USER_TACT_SW2: C709.2 R704.1 SW701.1
USER_TACT_SW3: C710.2 R705.1 SW702.1
USER_TACT_SW4: C711.2 R706.1 SW703.1

Not connected (* = marked no-connect by the designer): H700 1*; H701 1*; H702 1*; H703 1*; H704 1*; H705 1*; H706 1*; H707 1*; H708 1*; TFT700 29(~{CD})* 30(~{SD_CS})* 31(SD_MOSI)* 32(SD_MISO)* 33(SD_SCK)* 39(TS_SDA)* 40(TS_SCL)* 41(X+)* 42(Y+)* 43(X-)* 44(Y-)*

### Notes on the sheet
- MCU / FPGA / SOC  Test  Carrier  B'd - A (Rev.A)
- [7] Peripheral Part
- PL_B34_L12_N
- PL_B34_L15_N
- PS_UART1_TX
- PS_UART1_RX
- PL_B34_IO_25
- PL_B34_L21_P
- PL_B35_L14_P
- PS_I2C0_SCL
- PS_I2C0_SDA
- PS_SPI0_SCLK
- PL_B35_L10_N
- PL_B35_L15_N
- PL_B35_L5_P
- PS_SPI0_SS0
- PS_SPI0_MOSI
- PS_SPI0_MISO
- MCU_I/O_PA1_C
- MCU_I/O_PA11
- MCU_I/O_PH15
- MCU_I/O_PJ15
- (near CN702) MCU_USART2_TX
- (near CN702) MCU_USART2_RX
- (near CN702) MCU_I2C2_SCL
- (near CN702) MCU_I2C2_SDA
- CAN_H
- MCU_I/O_PK4
- MCU_I/O_PI4
- (near CN702) MCU_SPI4_SCK
- (near CN702) MCU_SPI4_MISO
- (near CN702) MCU_SPI4_MOSI
- CAN_L
- (near CN702) MCU_DAC1_OUT1
- Title
- Rev
- Doc
- Sheet #
- of
- Author
- This document is copyright of ArkX and shall not be revealed, produced, copied, in whole or in part,
- Date
- nor used for any purpose other than submitted.
- (in symbol SW_DSHP04TS-S) ON

### Library data of the parts
BZ700 = BZ_FQ-014: Magnetic Active Buzzer / Rated Voltage: 5V / Size: 9x5.5mm
C700 = CAP_22uF/25V/2012: Ceramic CAP_22uF/25V/2012; LCSC Part #: C45783; JLCPCB Part Type: Basic Part
C701 C703 C704 = CAP_10uF/10V/1608: Ceramic CAP_10uF/10V/1608; LCSC Part #: C19702; JLCPCB Part Type: Basic Part
C702 C705 C706 C708-C715 = CAP_100nF/16V/1005: Ceramic CAP_100nF/16V/1005; LCSC Part #: C1525; JLCPCB Part Type: Basic Part
C707 = CAP_2.2uF/16V/1608: Ceramic CAP_2.2uF/16V/1608; LCSC Part #: C23630; JLCPCB Part Type: Basic Part
CN700-CN703 = CON_SMW250-10: YEONHO 2.5mm Pitch Vertical Connector 10Pin
D700 = DIO_M7: 1A 5uA@1kV 1kV 1.1V@1A SMA(DO-214AC)  Diodes - General Purpose ROHS; LCSC Part #: C95872; JLCPCB Part Type: Basic Part
H700-H708 = HOLE_NTH-3.0MM: Non-Through Hole 3mm
LED700 LED701 = LED_RGB_MHT170RGBCT: Colorless transparence -30℃~+85℃ Positive post Common anode RGB 120° 0805  Light Emitting Diodes (LED) ROHS; LCSC Part #: C2962094; JLCPCB Part Type: Extended Part
Q700 = BJT_NPN_MMBT3904: 100nA 40V 200mW 200mA 100@10mA,1V 300MHz 300mV@50mA,5mA NPN +150℃@(Tj) SOT-23(SOT-23-3)  Bipolar Transistors - BJT ROHS; LCSC Part #: C20526; JLCPCB Part Type: Basic Part
R700 = RES_1K/1608/0.1W: Value: 1K; Power Rating: 0.1W; Precision: 1%; Size: 1608; LCSC Part #: C21190; JLCPCB Part Type: Basic Part
R701 = RES_4.7K/1608/0.1W: Value: 4.7K; Power Rating: 0.1W; Precision: 1%; Size: 1608; LCSC Part #: C23162; JLCPCB Part Type: Basic Part
R702 R707-R711 = RES_470R/1608/0.1W: Value: 470R; Power Rating: 0.1W; Precision: 1%; Size: 1608; LCSC Part #: C23179; JLCPCB Part Type: Basic Part
R703-R706 R712-R715 = RES_10K/1005/62.5mW: as R501 on sheet 05_FPGA_SOC_Part1; Size: 1005; LCSC Part #: C25744; JLCPCB Part Type: Basic Part
SW700-SW703 = SW_K2-1102SP-C4SC-04(2P): as SW500 on sheet 05_FPGA_SOC_Part1; LCSC Part #: C127509; JLCPCB Part Type: Extended Part
SW704 = SW_DSHP04TS-S: 4Bit SPST 24V 25mA Black 3千次 Slide (Standard),凹槽式 SMD-8P,5.4x6.7mm  DIP Switches ROHS; LCSC Part #: C319050; JLCPCB Part Type: Extended Part
TFT700 = LCD_TFT-32A

## Sheet 08_Target_Bd_Connector.SchDoc
size A4; SheetNumber: 8; SheetTotal: 8
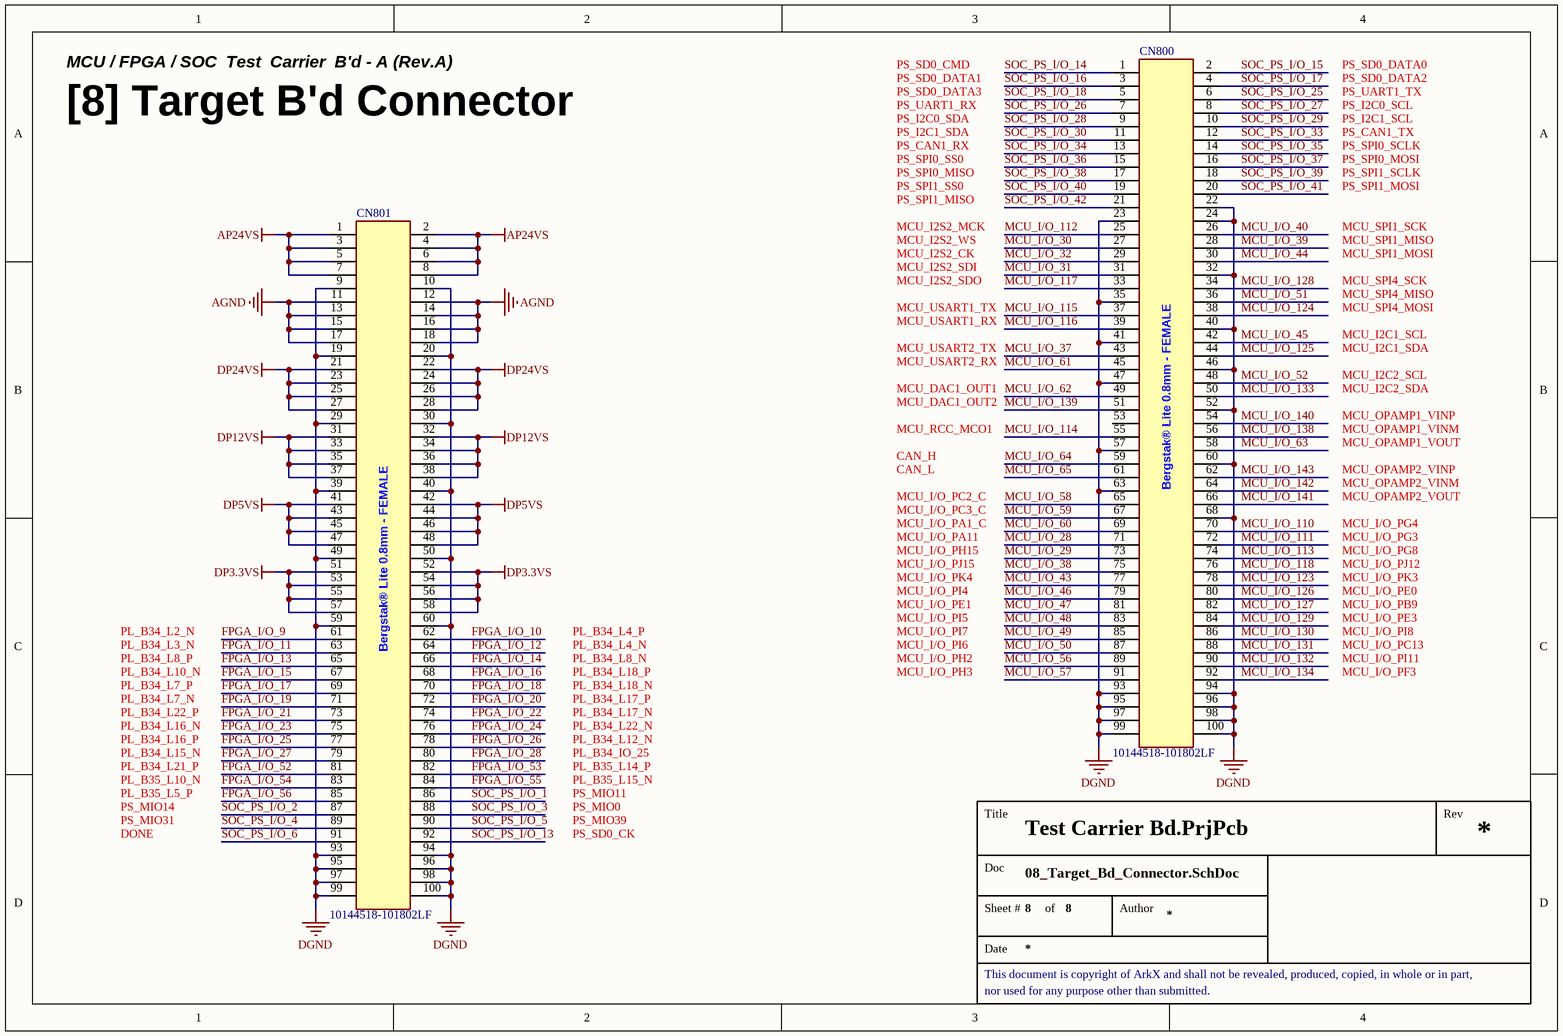
[diagram p7: 08_Target_Bd_Connector.SchDoc]

### Parts
CN800  10144518-101802LF  [CON_BergStak-Lite(0.8mm)_FEMALE-100P(10144518-101802LF)_HandSolder]
CN801  10144518-101802LF  [CON_BergStak-Lite(0.8mm)_FEMALE-100P(10144518-101802LF)_HandSolder]

### Nets
AGND: CN801.11 CN801.12 CN801.13 CN801.14 CN801.15 CN801.16 CN801.17 CN801.18
AP24VS: CN801.1 CN801.2 CN801.3 CN801.4 CN801.5 CN801.6 CN801.7 CN801.8
DGND: CN800.22 CN800.23 CN800.24 CN800.32 CN800.35 CN800.40 CN800.41 CN800.46 CN800.47 CN800.52 CN800.57 CN800.60 CN800.63 CN800.68 CN800.93 CN800.94 CN800.95 CN800.96 CN800.97 CN800.98 CN800.99 CN800.100 CN801.9 CN801.10 CN801.19 CN801.20 CN801.29 CN801.30 CN801.39 CN801.40 CN801.49 CN801.50 CN801.59 CN801.60 CN801.93 CN801.94 CN801.95 CN801.96 CN801.97 CN801.98 CN801.99 CN801.100
DP3.3VS: CN801.51 CN801.52 CN801.53 CN801.54 CN801.55 CN801.56 CN801.57 CN801.58
DP5VS: CN801.41 CN801.42 CN801.43 CN801.44 CN801.45 CN801.46 CN801.47 CN801.48
DP12VS: CN801.31 CN801.32 CN801.33 CN801.34 CN801.35 CN801.36 CN801.37 CN801.38
DP24VS: CN801.21 CN801.22 CN801.23 CN801.24 CN801.25 CN801.26 CN801.27 CN801.28
FPGA_I/O_9: CN801.61
FPGA_I/O_10: CN801.62
FPGA_I/O_11: CN801.63
FPGA_I/O_12: CN801.64
FPGA_I/O_13: CN801.65
FPGA_I/O_14: CN801.66
FPGA_I/O_15: CN801.67
FPGA_I/O_16: CN801.68
FPGA_I/O_17: CN801.69
FPGA_I/O_18: CN801.70
FPGA_I/O_19: CN801.71
FPGA_I/O_20: CN801.72
FPGA_I/O_21: CN801.73
FPGA_I/O_22: CN801.74
FPGA_I/O_23: CN801.75
FPGA_I/O_24: CN801.76
FPGA_I/O_25: CN801.77
FPGA_I/O_26: CN801.78
FPGA_I/O_27: CN801.79
FPGA_I/O_28: CN801.80
FPGA_I/O_52: CN801.81
FPGA_I/O_53: CN801.82
FPGA_I/O_54: CN801.83
FPGA_I/O_55: CN801.84
FPGA_I/O_56: CN801.85
MCU_I/O_28: CN800.71
MCU_I/O_29: CN800.73
MCU_I/O_30: CN800.27
MCU_I/O_31: CN800.31
MCU_I/O_32: CN800.29
MCU_I/O_37: CN800.43
MCU_I/O_38: CN800.75
MCU_I/O_39: CN800.28
MCU_I/O_40: CN800.26
MCU_I/O_43: CN800.77
MCU_I/O_44: CN800.30
MCU_I/O_45: CN800.42
MCU_I/O_46: CN800.79
MCU_I/O_47: CN800.81
MCU_I/O_48: CN800.83
MCU_I/O_49: CN800.85
MCU_I/O_50: CN800.87
MCU_I/O_51: CN800.36
MCU_I/O_52: CN800.48
MCU_I/O_56: CN800.89
MCU_I/O_57: CN800.91
MCU_I/O_58: CN800.65
MCU_I/O_59: CN800.67
MCU_I/O_60: CN800.69
MCU_I/O_61: CN800.45
MCU_I/O_62: CN800.49
MCU_I/O_63: CN800.58
MCU_I/O_64: CN800.59
MCU_I/O_65: CN800.61
MCU_I/O_110: CN800.70
MCU_I/O_111: CN800.72
MCU_I/O_112: CN800.25
MCU_I/O_113: CN800.74
MCU_I/O_114: CN800.55
MCU_I/O_115: CN800.37
MCU_I/O_116: CN800.39
MCU_I/O_117: CN800.33
MCU_I/O_118: CN800.76
MCU_I/O_123: CN800.78
MCU_I/O_124: CN800.38
MCU_I/O_125: CN800.44
MCU_I/O_126: CN800.80
MCU_I/O_127: CN800.82
MCU_I/O_128: CN800.34
MCU_I/O_129: CN800.84
MCU_I/O_130: CN800.86
MCU_I/O_131: CN800.88
MCU_I/O_132: CN800.90
MCU_I/O_133: CN800.50
MCU_I/O_134: CN800.92
MCU_I/O_138: CN800.56
MCU_I/O_139: CN800.51
MCU_I/O_140: CN800.54
MCU_I/O_141: CN800.66
MCU_I/O_142: CN800.64
MCU_I/O_143: CN800.62
SOC_PS_I/O_1: CN801.86
SOC_PS_I/O_2: CN801.87
SOC_PS_I/O_3: CN801.88
SOC_PS_I/O_4: CN801.89
SOC_PS_I/O_5: CN801.90
SOC_PS_I/O_6: CN801.91
SOC_PS_I/O_13: CN801.92
SOC_PS_I/O_14: CN800.1
SOC_PS_I/O_15: CN800.2
SOC_PS_I/O_16: CN800.3
SOC_PS_I/O_17: CN800.4
SOC_PS_I/O_18: CN800.5
SOC_PS_I/O_25: CN800.6
SOC_PS_I/O_26: CN800.7
SOC_PS_I/O_27: CN800.8
SOC_PS_I/O_28: CN800.9
SOC_PS_I/O_29: CN800.10
SOC_PS_I/O_30: CN800.11
SOC_PS_I/O_33: CN800.12
SOC_PS_I/O_34: CN800.13
SOC_PS_I/O_35: CN800.14
SOC_PS_I/O_36: CN800.15
SOC_PS_I/O_37: CN800.16
SOC_PS_I/O_38: CN800.17
SOC_PS_I/O_39: CN800.18
SOC_PS_I/O_40: CN800.19
SOC_PS_I/O_41: CN800.20
SOC_PS_I/O_42: CN800.21

Not connected (* = marked no-connect by the designer): CN800 53

### Notes on the sheet
- MCU / FPGA / SOC  Test  Carrier  B'd - A (Rev.A)
- PS_SD0_CMD
- PS_SD0_DATA1
- PS_SD0_DATA3
- PS_UART1_RX
- PS_SD0_DATA0
- PS_SD0_DATA2
- PS_UART1_TX
- PS_I2C0_SCL
- [8] Target B'd Connector
- PS_I2C0_SDA
- PS_I2C1_SDA
- PS_CAN1_RX
- PS_SPI0_SS0
- PS_SPI0_MISO
- PS_I2C1_SCL
- PS_CAN1_TX
- PS_SPI0_SCLK
- PS_SPI0_MOSI
- PS_SPI1_SCLK
- MCU_I2S2_WS
- MCU_I2S2_MCK
- PS_SPI1_SS0
- PS_SPI1_MISO
- MCU_SPI1_SCK
- MCU_SPI1_MISO
- PS_SPI1_MOSI
- MCU_I2S2_CK
- MCU_I2S2_SDI
- MCU_I2S2_SDO
- MCU_USART1_TX
- MCU_SPI1_MOSI
- MCU_SPI4_SCK
- MCU_SPI4_MISO
- MCU_SPI4_MOSI
- MCU_USART1_RX
- MCU_USART2_TX
- MCU_USART2_RX
- MCU_I2C1_SCL
- MCU_I2C1_SDA
- MCU_I2C2_SCL
- MCU_DAC1_OUT1
- MCU_DAC1_OUT2
- MCU_RCC_MCO1
- MCU_I2C2_SDA
- MCU_OPAMP1_VOUT
- MCU_OPAMP1_VINM
- MCU_OPAMP1_VINP
- CAN_H
- CAN_L
- MCU_I/O_PC2_C
- MCU_I/O_PC3_C
- MCU_OPAMP2_VOUT
- MCU_OPAMP2_VINM
- MCU_OPAMP2_VINP
- MCU_I/O_PA1_C
- MCU_I/O_PA11
- MCU_I/O_PH15
- MCU_I/O_PJ15
- MCU_I/O_PK4
- MCU_I/O_PG4
- MCU_I/O_PG3
- MCU_I/O_PG8
- MCU_I/O_PJ12
- MCU_I/O_PK3
- PL_B34_L2_N
- PL_B34_L3_N
- PL_B34_L4_P
- PL_B34_L4_N
- MCU_I/O_PI4
- MCU_I/O_PE1
- MCU_I/O_PI5
- MCU_I/O_PI7
- MCU_I/O_PI6
- MCU_I/O_PE0
- MCU_I/O_PB9
- MCU_I/O_PE3
- MCU_I/O_PI8
- MCU_I/O_PC13
- PL_B34_L8_P
- PL_B34_L10_N
- PL_B34_L7_P
- PL_B34_L7_N
- PL_B34_L22_P
- PL_B34_L8_N
- PL_B34_L18_P
- PL_B34_L18_N
- PL_B34_L17_P
- PL_B34_L17_N
- MCU_I/O_PH2
- MCU_I/O_PH3
- MCU_I/O_PI11
- MCU_I/O_PF3
- PL_B34_L16_N
- PL_B34_L16_P
- PL_B34_L15_N
- PL_B34_L21_P
- PL_B35_L10_N
- PL_B34_L22_N
- PL_B34_L12_N
- PL_B34_IO_25
- PL_B35_L14_P
- PL_B35_L15_N
- PL_B35_L5_P
- PS_MIO14
- PS_MIO31
- DONE
- PS_MIO11
- PS_MIO0
- PS_MIO39
- PS_SD0_CK
- Title
- Rev
- Doc
- Sheet #
- of
- Author
- This document is copyright of ArkX and shall not be revealed, produced, copied, in whole or in part,
- Date
- nor used for any purpose other than submitted.
- (in symbol CON_BergStak-Lite(0.8mm)_FEMALE-100P(10144518-101802LF)) Bergstak® Lite 0.8mm - FEMALE

### Library data of the parts
CN800 CN801 = CON_BergStak-Lite(0.8mm)_FEMALE-100P(10144518-101802LF): JLCPCB Part Type: Extended Part